# Altium project PnP.PrjPcb (part 1 of 2)
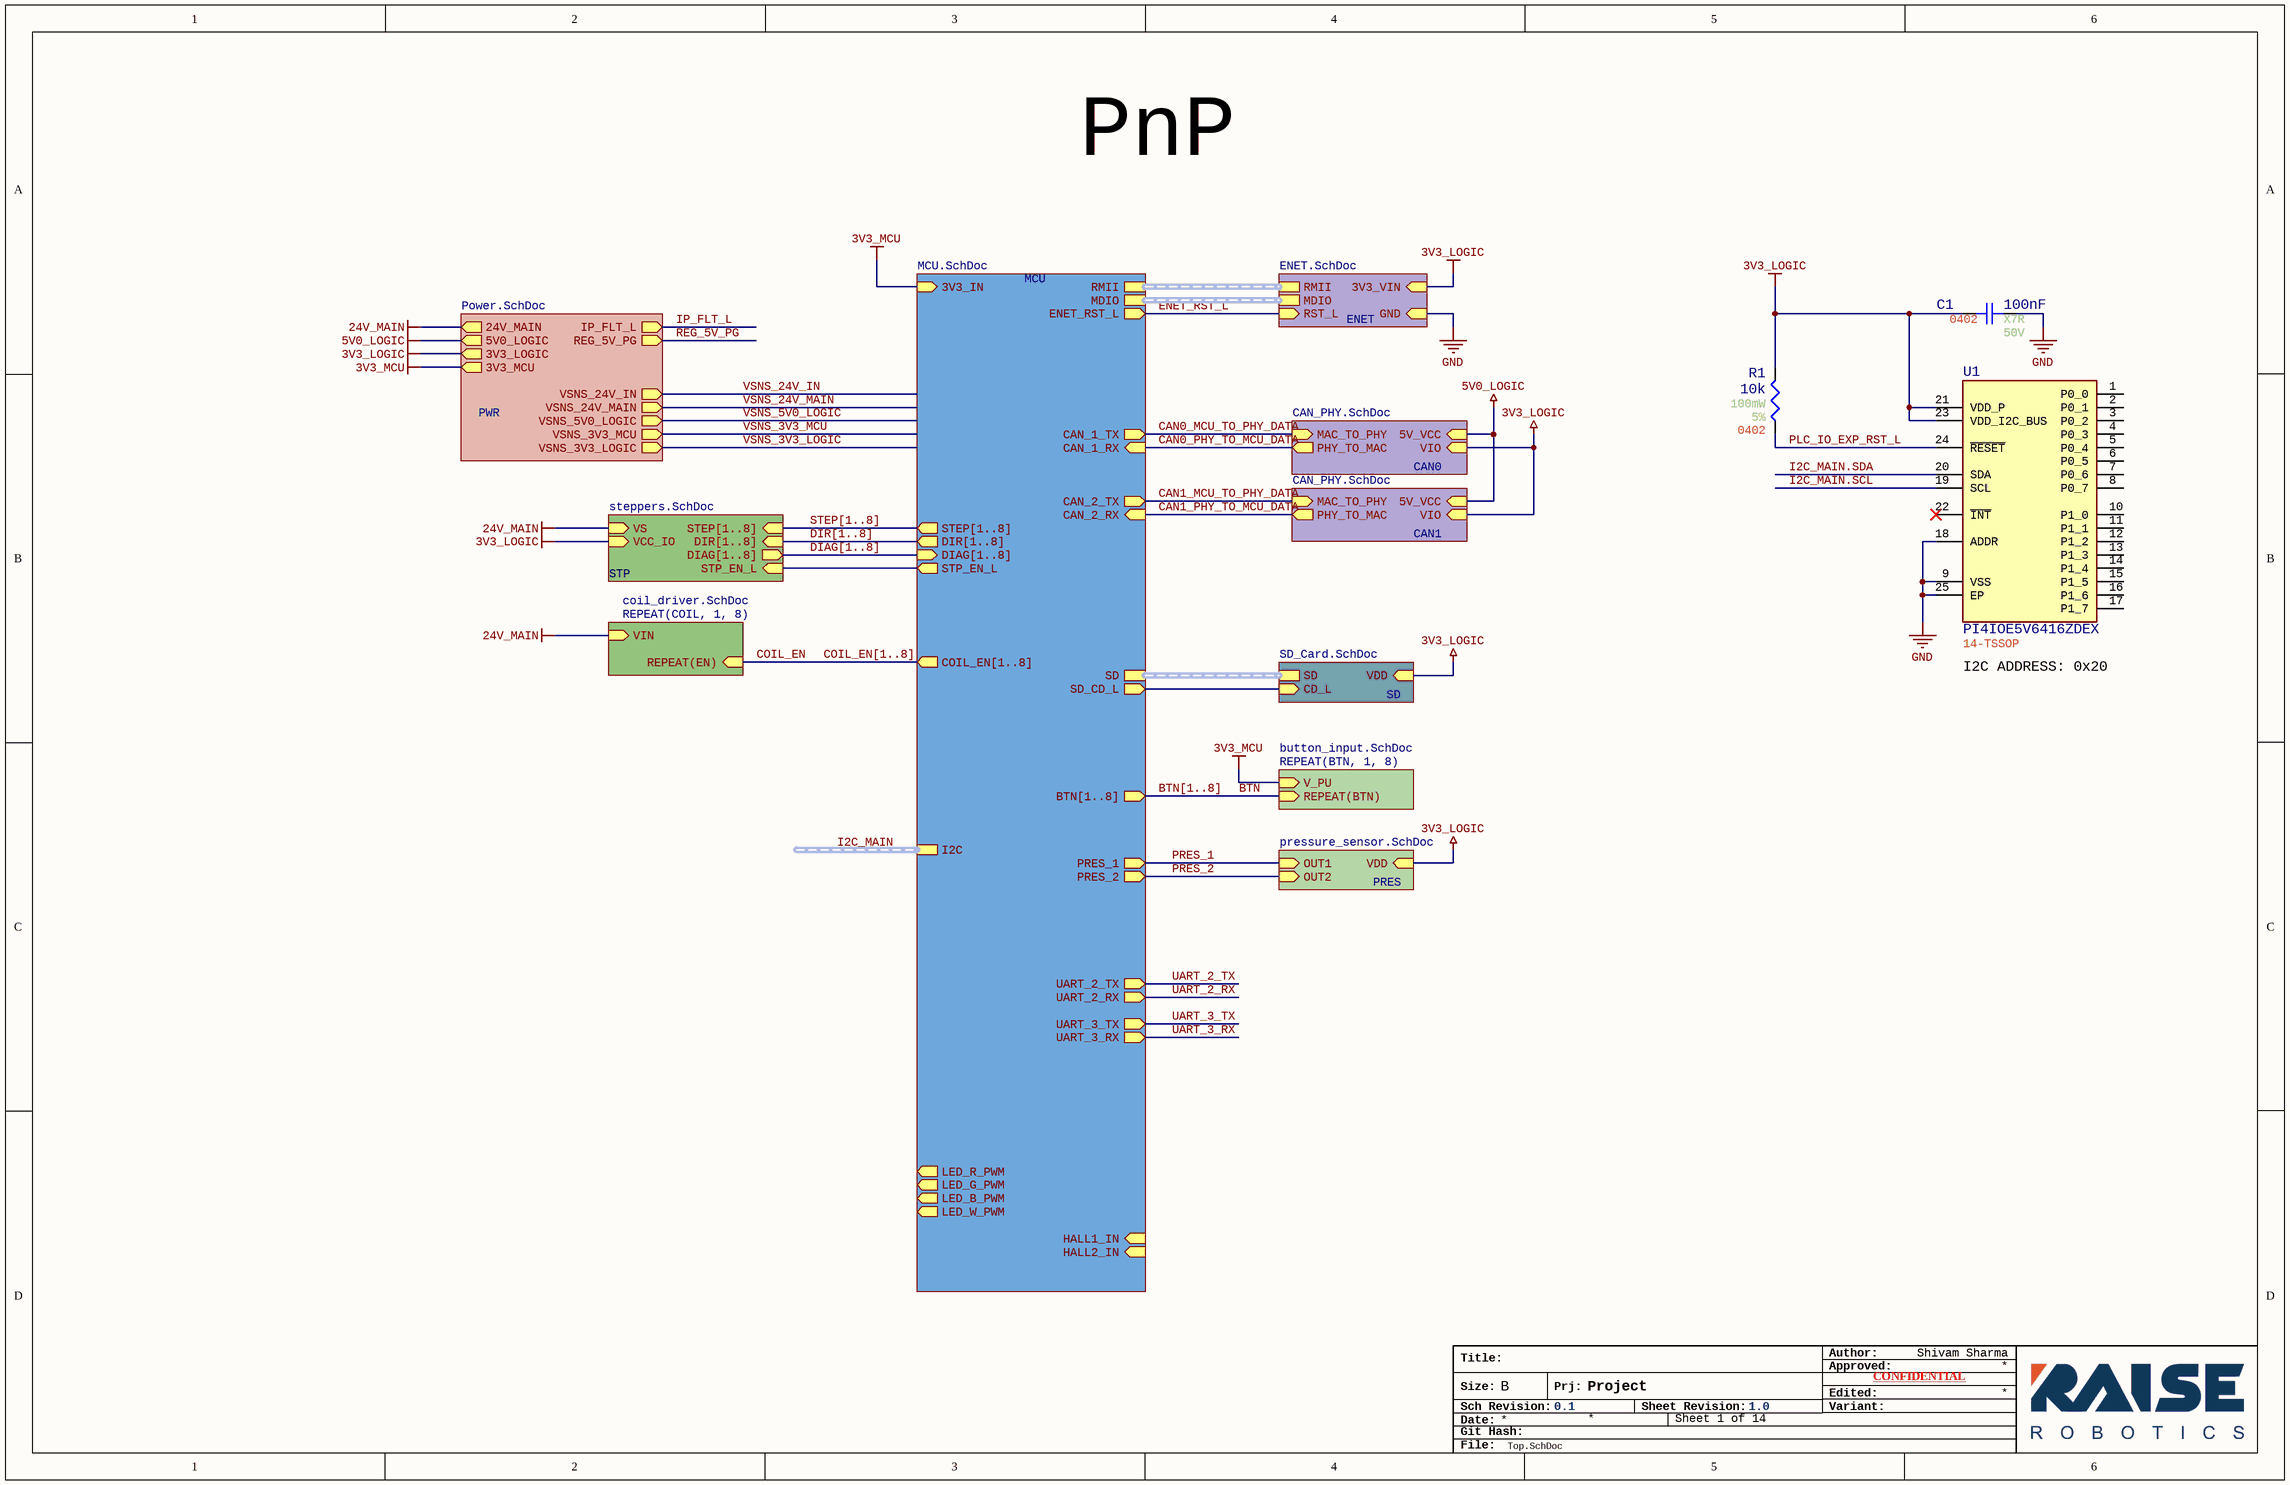
[diagram p0: Top.SchDoc]
PCBRevision: 0.0.1; ProjectTitle: Project; RR_PlaceNear: [{"paramVis":true,"a":{"refdes":"C7_MCU","srcUid":"MKZOVQBG","pin":"2"},"b":{"refdes":"U1_MCU","srcUid":"YJUBBWJW","pin":"73"},"mm":5},{"paramVis":true,"a":{"refdes":"C8_MCU","srcUid":"ILMRNPTO","pin":"2"},"b":{"refdes":"U1_MCU","srcUid":"YJUBBWJW","pin":"48"},"mm":5},{"paramVis":true,"a":{"refdes":"C13_MCU","srcUid":"YBZUFTTK","pin":"2"},"b":{"refdes":"U1_MCU","srcUid":"YJUBBWJW","pin":"100"},"mm":5},{"paramVis":true,"a":{"refdes":"C14_MCU","srcUid":"XZGWUZUA","pin":"2"},"b":{"refdes":"U1_MCU","srcUid":"YJUBBWJW","pin":"11"},"mm":5},{"paramVis":true,"a":{"refdes":"C15_MCU","srcUid":"LAALGSAD","pin":"2"},"b":{"refdes":"U1_MCU","srcUid":"YJUBBWJW","pin":"27"},"mm":5},{"paramVis":true,"a":{"refdes":"C16_MCU","srcUid":"AYAAMLSY","pin":"2"},"b":{"refdes":"U1_MCU","srcUid":"YJUBBWJW","pin":"50"},"mm":5},{"paramVis":true,"a":{"refdes":"C17_MCU","srcUid":"DWRWYZPW","pin":"2"},"b":{"refdes":"U1_MCU","srcUid":"YJUBBWJW","pin":"75"},"mm":5},{"paramVis":true,"a":{"refdes":"C18_MCU","srcUid":"ULGSEDIV","pin":"2"},"b":{"refdes":"U1_MCU","srcUid":"YJUBBWJW","pin":"21"},"mm":5}]; SchRevision: 0.1
12 sheets, 323 parts. Net scope: hierarchical (ports join the sheet entries above them; power ports are global).
Board file: Project.PcbDoc
Sheets:
  Top.SchDoc
    MCU = MCU.SchDoc
    PWR = Power.SchDoc
      U_Input_Protection = Input_Protection.SchDoc
      U_5V_Buck = 5V_Buck.SchDoc
    CAN0 = CAN_PHY.SchDoc
    CAN1 = CAN_PHY.SchDoc
    ENET = ENET.SchDoc
    SD = SD_Card.SchDoc
    BTN1 = button_input.SchDoc
    BTN2 = button_input.SchDoc
    BTN3 = button_input.SchDoc
    BTN4 = button_input.SchDoc
    BTN5 = button_input.SchDoc
    BTN6 = button_input.SchDoc
    BTN7 = button_input.SchDoc
    BTN8 = button_input.SchDoc
    STP = steppers.SchDoc
      STP1 = stepper_driver.SchDoc
      STP2 = stepper_driver.SchDoc
      STP3 = stepper_driver.SchDoc
      STP4 = stepper_driver.SchDoc
      STP5 = stepper_driver.SchDoc
      STP6 = stepper_driver.SchDoc
      STP7 = stepper_driver.SchDoc
      STP8 = stepper_driver.SchDoc
    COIL1 = coil_driver.SchDoc
    COIL2 = coil_driver.SchDoc
    COIL3 = coil_driver.SchDoc
    COIL4 = coil_driver.SchDoc
    COIL5 = coil_driver.SchDoc
    COIL6 = coil_driver.SchDoc
    COIL7 = coil_driver.SchDoc
    COIL8 = coil_driver.SchDoc

## Sheet Top.SchDoc
size 431 x 279 mm; Author: Shivam Sharma; SheetNumber: 1; SheetTotal: 14; SheetRevision: 1.0

### Parts
C1  value 100nF  Temperature Coefficient: X7R  Voltage Rating: 50V  Case/Package: 0402  [Generic 0402 capacitor]  (hidden comment: GRT155R71H104KE01D)
R1  value 10k  Power: 100mW  Tolerance: 5%  Case/Package: 0402  [Generic 0402 Resistor]  (hidden comment: ERJ-2GEJ103X)
U1  PI4IOE5V6416ZDEX  Case/Package: 14-TSSOP  [PI4IOE5V6416ZDEX]

### Sub-sheets
CAN0 = CAN_PHY.SchDoc: 5V_VCC (in), VIO (in), MAC_TO_PHY (in), PHY_TO_MAC (out)
CAN1 = CAN_PHY.SchDoc: 5V_VCC (in), VIO (in), MAC_TO_PHY (in), PHY_TO_MAC (out)
ENET = ENET.SchDoc: 3V3_VIN (in), GND (in), MDIO (harness MDIO), RMII (harness RMII), RST_L (in)
MCU = MCU.SchDoc: RMII (harness RMII), CAN_1_RX (in), CAN_1_TX (out), 3V3_IN (in), SD (harness SD), LED_R_PWM (out), LED_G_PWM (out), LED_B_PWM (out), LED_W_PWM (out), HALL2_IN (in), HALL1_IN (in), MDIO (harness MDIO), ENET_RST_L (out), SD_CD_L (out), UART_2_TX (out), UART_2_RX (out), UART_3_TX (out), UART_3_RX (out), CAN_2_RX (in), CAN_2_TX (out), STEP[1..8] (out), DIR[1..8] (out), DIAG[1..8] (in), STP_EN_L (out), I2C (harness I2C), COIL_EN[1..8] (out), BTN[1..8] (out), PRES_1 (out), PRES_2 (out)
PRES = pressure_sensor.SchDoc (file not in this document): VDD (in), OUT1 (in), OUT2 (in)
PWR = Power.SchDoc: IP_FLT_L (out), 24V_MAIN (out), 3V3_MCU (out), 3V3_LOGIC (out), 5V0_LOGIC (out), REG_5V_PG (out), VSNS_24V_IN (out), VSNS_24V_MAIN (out), VSNS_5V0_LOGIC (out), VSNS_3V3_MCU (out), VSNS_3V3_LOGIC (out)
REPEAT(BTN, 1, 8) = button_input.SchDoc: V_PU (in), REPEAT(BTN) (in)
REPEAT(COIL, 1, 8) = coil_driver.SchDoc: VIN (in), REPEAT(EN) (in)
SD = SD_Card.SchDoc: SD (harness SD), VDD (in), CD_L (in)
STP = steppers.SchDoc: STP_EN_L (in), DIAG[1..8] (out), VS (in), VCC_IO (in), STEP[1..8] (in), DIR[1..8] (in)

### Nets
3V3_LOGIC: C1.2 R1.2 U1.21(VDD_P) U1.23(VDD_I2C_BUS) ; sheet PWR/3V3_LOGIC, sheet CAN0/VIO, sheet CAN1/VIO, sheet ENET/3V3_VIN, sheet SD/VDD, sheet STP/VCC_IO, sheet PRES/VDD
3V3_MCU: sheet MCU/3V3_IN, sheet PWR/3V3_MCU, sheet REPEAT(BTN, 1, 8)/V_PU
5V0_LOGIC: sheet PWR/5V0_LOGIC, sheet CAN0/5V_VCC, sheet CAN1/5V_VCC
24V_MAIN: sheet PWR/24V_MAIN, sheet STP/VS, sheet REPEAT(COIL, 1, 8)/VIN
GND: C1.1 U1.9(VSS) U1.18(ADDR) U1.25(EP) ; sheet ENET/GND
BTN: sheet REPEAT(BTN, 1, 8)/REPEAT(BTN)
CAN0_MCU_TO_PHY_DATA: sheet MCU/CAN_1_TX, sheet CAN0/MAC_TO_PHY
CAN0_PHY_TO_MCU_DATA: sheet MCU/CAN_1_RX, sheet CAN0/PHY_TO_MAC
CAN1_MCU_TO_PHY_DATA: sheet MCU/CAN_2_TX, sheet CAN1/MAC_TO_PHY
CAN1_PHY_TO_MCU_DATA: sheet MCU/CAN_2_RX, sheet CAN1/PHY_TO_MAC
COIL_EN: sheet REPEAT(COIL, 1, 8)/REPEAT(EN)
ENET_RST_L: sheet MCU/ENET_RST_L, sheet ENET/RST_L
I2C_MAIN.SCL: U1.19(SCL)
I2C_MAIN.SDA: U1.20(SDA)
IP_FLT_L: sheet PWR/IP_FLT_L
PLC_IO_EXP_RST_L: R1.1 U1.24(~{RESET})
PRES_1: sheet MCU/PRES_1, sheet PRES/OUT1
PRES_2: sheet MCU/PRES_2, sheet PRES/OUT2
REG_5V_PG: sheet PWR/REG_5V_PG
SD_CD_L: sheet MCU/SD_CD_L, sheet SD/CD_L
STP_EN_L: sheet MCU/STP_EN_L, sheet STP/STP_EN_L
UART_2_RX: sheet MCU/UART_2_RX
UART_2_TX: sheet MCU/UART_2_TX
UART_3_RX: sheet MCU/UART_3_RX
UART_3_TX: sheet MCU/UART_3_TX

Not connected (* = marked no-connect by the designer): U1 1(P0_0) 2(P0_1) 3(P0_2) 4(P0_3) 5(P0_4) 6(P0_5) 7(P0_6) 8(P0_7) 10(P1_0) 11(P1_1) 12(P1_2) 13(P1_3) 14(P1_4) 15(P1_5) 16(P1_6) 17(P1_7) 22(~{INT})*

### Buses and harness runs
bus BTN[1..8] = sheet MCU/BTN[1..8]
bus COIL_EN[1..8] = sheet MCU/COIL_EN[1..8]
bus DIAG[1..8] = sheet MCU/DIAG[1..8] = sheet STP/DIAG[1..8]
bus DIR[1..8] = sheet MCU/DIR[1..8] = sheet STP/DIR[1..8]
bus STEP[1..8] = sheet MCU/STEP[1..8] = sheet STP/STEP[1..8]
harness I2C_MAIN = sheet MCU/I2C
harness sheet ENET/MDIO = sheet MCU/MDIO
harness sheet ENET/RMII = sheet MCU/RMII
harness sheet MCU/SD = sheet SD/SD

### Notes on the sheet
- PnP
- (near U1) I2C ADDRESS: 0x20
- Title:
- Author:
- Approved:
- Size:
- Date:
- Git Hash:
- Sch Revision:
- B
- Prj:
- Sheet Revision:
- Variant:
- Edited:
- CONFIDENTIAL
- File:

### Library data of the parts
C1 = CMP-001-00084-12: Ceramic Capacitor, Multilayer, Ceramic, 50V, 10% +Tol, 10% -Tol, X7R, 15% TC, 0.1uF, Surface Mount, 0402; AECQ: Yes; Reach SVHC Compliant: Yes; Mounting Technology: Surface Mount; Termination: Wraparound; Pins: 2; Packaging: Tape and Reel; Package Shape: Rectangular; Multilayer: Yes; Tolerance: 10%; Max Operating Temperature: 125°C; Terminal Finish: Nickel; Capacitor Type: Ceramic; Dielectric Material: Ceramic; Min Operating Temperature: -55°C; RoHS Compliant: Yes
R1 = CMP-009-00185-9: Res Thick Film 0402 10K Ohm 5% 1/10W ±200ppm/°C Molded SMD Punched Carrier T/R; AECQ: No; Pins: 2; Max Operating Temperature: 155°C; RoHS Compliant: Yes; Min Operating Temperature: -55°C; Mounting Technology: Surface Mount
U1 = CMP-031-00013-2: 16-bit I2C General Purpose IO Expander with Interrupt, Reset, -40 to 85 °C, RoHS; Number of Circuits: 1; AECQ: No; Min Supply Voltage: 1.65V; Max Supply Voltage: 5.5V; Number of Terminals: 24; Schedule B: 8542390000, 8542390000; Pins: 14; RoHS: Compliant; Max Operating Temperature: 85°C; Lifecycle Status: Production; Terminal Pitch: 500µm; Width: 4mm; Min Operating Temperature: -40°C; REACH SVHC: Yes; Length: 4mm; Height - Seated (Max): 900µm; MPN: PI4IOE5V6416ZDEX

## Sheet MCU.SchDoc
size 431 x 279 mm; Author: Shivam Sharma; SheetNumber: 2; SheetTotal: 14
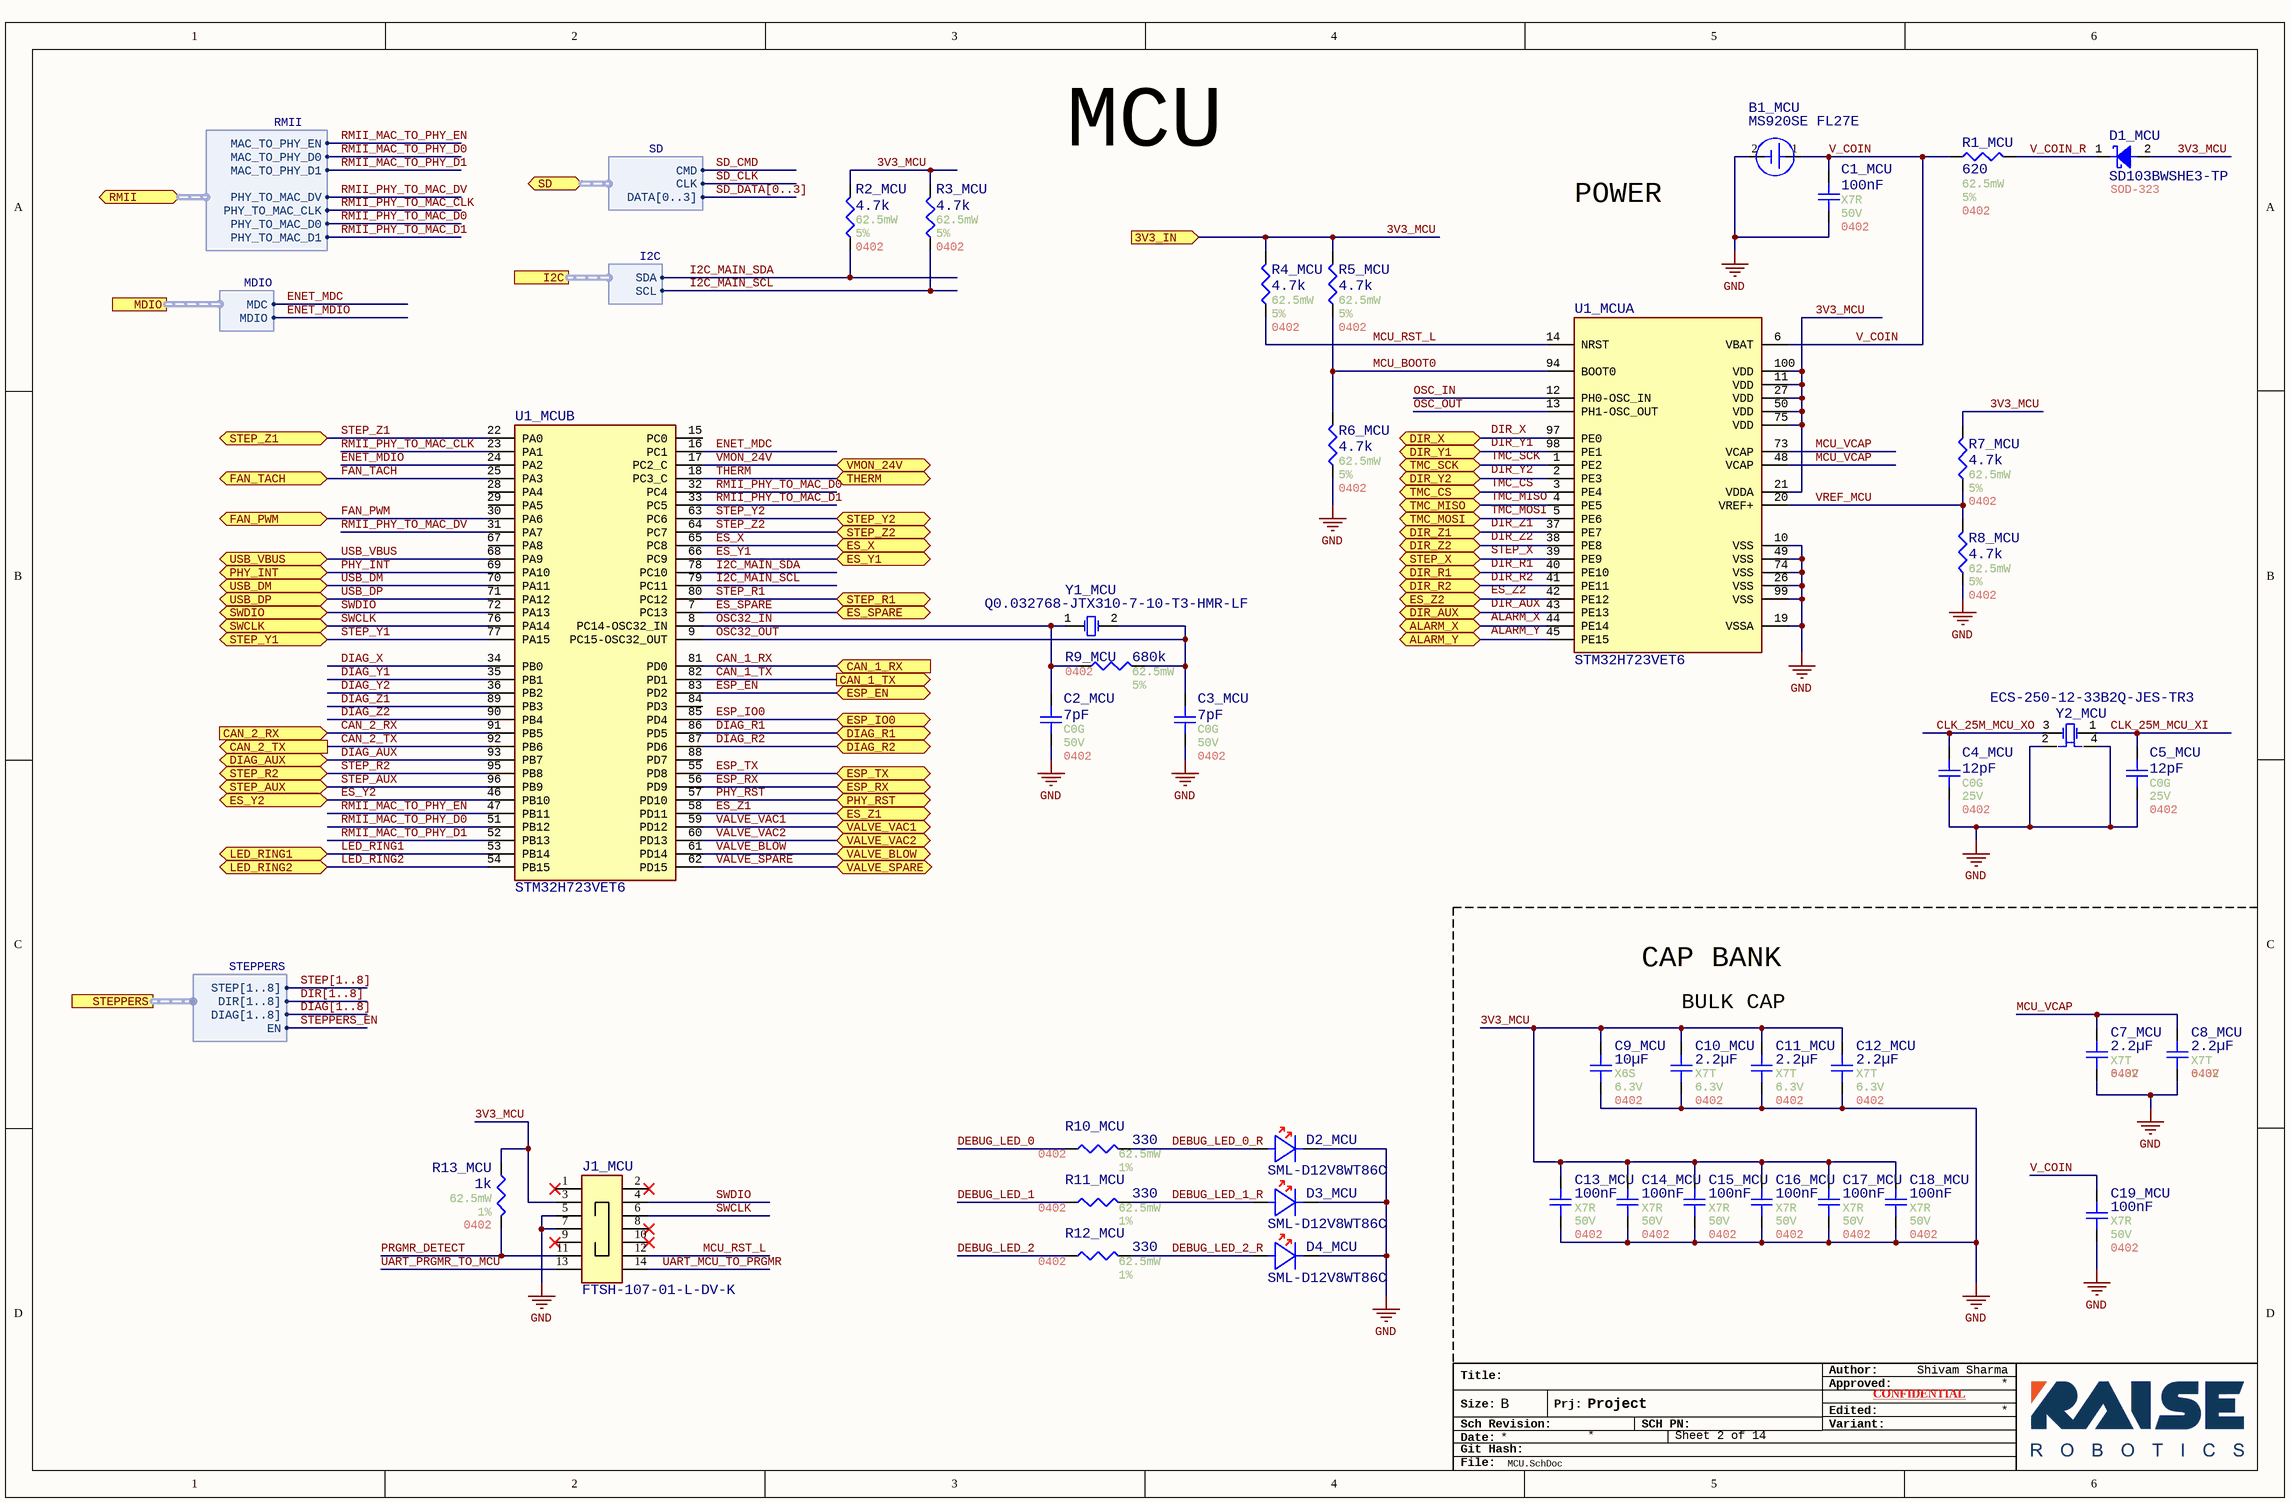
[diagram p1: MCU.SchDoc]

### Parts
B1_MCU  MS920SE FL27E  [MS920SE-FL27E]
C1_MCU  value 100nF  Temperature Coefficient: X7R  Voltage Rating: 50V  Case/Package: 0402  [Generic 0402 capacitor]  (hidden comment: GRT155R71H104KE01D)
C2_MCU  value 7pF  Temperature Coefficient: C0G  Voltage Rating: 50V  Case/Package: 0402  [Generic 0402 capacitor]  (hidden comment: GCM1555C1H7R0CA16J)
C3_MCU  value 7pF  Temperature Coefficient: C0G  Voltage Rating: 50V  Case/Package: 0402  [Generic 0402 capacitor]  (hidden comment: GCM1555C1H7R0CA16J)
C4_MCU  value 12pF  Temperature Coefficient: C0G  Voltage Rating: 25V  Case/Package: 0402  [Generic 0402 capacitor]  (hidden comment: GRT1555C1E120JA02J)
C5_MCU  value 12pF  Temperature Coefficient: C0G  Voltage Rating: 25V  Case/Package: 0402  [Generic 0402 capacitor]  (hidden comment: GRT1555C1E120JA02J)
C7_MCU  value 2.2µF  Temperature Coefficient: X7T  Voltage Rating: 6.3V  Case/Package: 0402  [Generic 0402 capacitor]  (hidden comment: MAASJ105CD7225MFCA01)
C8_MCU  value 2.2µF  Temperature Coefficient: X7T  Voltage Rating: 6.3V  Case/Package: 0402  [Generic 0402 capacitor]  (hidden comment: MAASJ105CD7225MFCA01)
C9_MCU  value 10µF  Temperature Coefficient: X6S  Voltage Rating: 6.3V  Case/Package: 0402  [Generic 0402 capacitor]  (hidden comment: GRT155C80J106ME13J)
C10_MCU  value 2.2µF  Temperature Coefficient: X7T  Voltage Rating: 6.3V  Case/Package: 0402  [Generic 0402 capacitor]  (hidden comment: MAASJ105CD7225MFCA01)
C11_MCU  value 2.2µF  Temperature Coefficient: X7T  Voltage Rating: 6.3V  Case/Package: 0402  [Generic 0402 capacitor]  (hidden comment: MAASJ105CD7225MFCA01)
C12_MCU  value 2.2µF  Temperature Coefficient: X7T  Voltage Rating: 6.3V  Case/Package: 0402  [Generic 0402 capacitor]  (hidden comment: MAASJ105CD7225MFCA01)
C13_MCU  value 100nF  Temperature Coefficient: X7R  Voltage Rating: 50V  Case/Package: 0402  [Generic 0402 capacitor]  (hidden comment: GRT155R71H104KE01D)
C14_MCU  value 100nF  Temperature Coefficient: X7R  Voltage Rating: 50V  Case/Package: 0402  [Generic 0402 capacitor]  (hidden comment: GRT155R71H104KE01D)
C15_MCU  value 100nF  Temperature Coefficient: X7R  Voltage Rating: 50V  Case/Package: 0402  [Generic 0402 capacitor]  (hidden comment: GRT155R71H104KE01D)
C16_MCU  value 100nF  Temperature Coefficient: X7R  Voltage Rating: 50V  Case/Package: 0402  [Generic 0402 capacitor]  (hidden comment: GRT155R71H104KE01D)
C17_MCU  value 100nF  Temperature Coefficient: X7R  Voltage Rating: 50V  Case/Package: 0402  [Generic 0402 capacitor]  (hidden comment: GRT155R71H104KE01D)
C18_MCU  value 100nF  Temperature Coefficient: X7R  Voltage Rating: 50V  Case/Package: 0402  [Generic 0402 capacitor]  (hidden comment: GRT155R71H104KE01D)
C19_MCU  value 100nF  Temperature Coefficient: X7R  Voltage Rating: 50V  Case/Package: 0402  [Generic 0402 capacitor]  (hidden comment: GRT155R71H104KE01D)
D1_MCU  SD103BWSHE3-TP  [SOD-323]
D2_MCU  SML-D12V8WT86C  [FP-SML-D12-MFG]
D3_MCU  SML-D12V8WT86C  [FP-SML-D12-MFG]
D4_MCU  SML-D12V8WT86C  [FP-SML-D12-MFG]
J1_MCU  FTSH-107-01-L-DV-K  [FTSH-107-01-L-DV-K-TR]
R1_MCU  value 620  Power: 62.5mW  Tolerance: 5%  Case/Package: 0402  [Generic 0402 Resistor]  (hidden comment: RC0402JR-07620RL)
R2_MCU  value 4.7k  Power: 62.5mW  Tolerance: 5%  Case/Package: 0402  [Generic 0402 Resistor]  (hidden comment: WR04X472JTL)
R3_MCU  value 4.7k  Power: 62.5mW  Tolerance: 5%  Case/Package: 0402  [Generic 0402 Resistor]  (hidden comment: WR04X472JTL)
R4_MCU  value 4.7k  Power: 62.5mW  Tolerance: 5%  Case/Package: 0402  [Generic 0402 Resistor]  (hidden comment: WR04X472JTL)
R5_MCU  value 4.7k  Power: 62.5mW  Tolerance: 5%  Case/Package: 0402  [Generic 0402 Resistor]  (hidden comment: WR04X472JTL)
R6_MCU  value 4.7k  Power: 62.5mW  Tolerance: 5%  Case/Package: 0402  [Generic 0402 Resistor]  (hidden comment: WR04X472JTL)
R7_MCU  value 4.7k  Power: 62.5mW  Tolerance: 5%  Case/Package: 0402  [Generic 0402 Resistor]  (hidden comment: WR04X472JTL)
R8_MCU  value 4.7k  Power: 62.5mW  Tolerance: 5%  Case/Package: 0402  [Generic 0402 Resistor]  (hidden comment: WR04X472JTL)
R9_MCU  value 680k  Power: 62.5mW  Tolerance: 5%  Case/Package: 0402  [Generic 0402 Resistor]  (hidden comment: AC0402JR-07680KL)
R10_MCU  value 330  Power: 62.5mW  Tolerance: 1%  Case/Package: 0402  [Generic 0402 Resistor]  (hidden comment: RMCF0402FT330R)
R11_MCU  value 330  Power: 62.5mW  Tolerance: 1%  Case/Package: 0402  [Generic 0402 Resistor]  (hidden comment: RMCF0402FT330R)
R12_MCU  value 330  Power: 62.5mW  Tolerance: 1%  Case/Package: 0402  [Generic 0402 Resistor]  (hidden comment: RMCF0402FT330R)
R13_MCU  value 1k  Power: 62.5mW  Tolerance: 1%  Case/Package: 0402  [Generic 0402 Resistor]  (hidden comment: WR04X1001FTL)
U1_MCU  STM32H723VET6  [STM32H723VxT]  (parts A,B of 2)
Y1_MCU  Q0.032768-JTX310-7-10-T3-HMR-LF  [JTX310]
Y2_MCU  ECS-250-12-33B2Q-JES-TR3  [ECS-250-12-33B2Q-JES-TR3]

### Ports
3V3_IN (in), ALARM_X (bidir), ALARM_Y (bidir), CAN_1_RX (in), CAN_1_TX (out), CAN_2_RX (in), CAN_2_TX (out), DIAG_AUX (bidir), DIAG_R1 (bidir), DIAG_R2 (bidir), DIR_AUX (bidir), DIR_R1 (bidir), DIR_R2 (bidir), DIR_X (bidir), DIR_Y1 (bidir), DIR_Y2 (bidir), DIR_Z1 (bidir), DIR_Z2 (bidir), ES_SPARE (bidir), ES_X (bidir), ES_Y1 (bidir), ES_Y2 (bidir), ES_Z1 (bidir), ES_Z2 (bidir), ESP_EN (bidir), ESP_IO0 (bidir), ESP_RX (bidir), ESP_TX (bidir), FAN_PWM (bidir), FAN_TACH (bidir), I2C (harness I2C), LED_RING1 (bidir), LED_RING2 (bidir), MDIO (harness MDIO), PHY_INT (bidir), PHY_RST (bidir), RMII (bidir, harness RMII), SD (bidir, harness SD), STEP_AUX (bidir), STEP_R1 (bidir), STEP_R2 (bidir), STEP_X (bidir), STEP_Y1 (bidir), STEP_Y2 (bidir), STEP_Z1 (bidir), STEP_Z2 (bidir), STEPPERS (harness STEPPERS), SWCLK (bidir), SWDIO (bidir), THERM (bidir), TMC_CS (bidir), TMC_MISO (bidir), TMC_MOSI (bidir), TMC_SCK (bidir), USB_DM (bidir), USB_DP (bidir), USB_VBUS (bidir), VALVE_BLOW (bidir), VALVE_SPARE (bidir), VALVE_VAC1 (bidir), VALVE_VAC2 (bidir), VMON_24V (bidir)

### Harnesses
RMII: MAC_TO_PHY_D0, MAC_TO_PHY_D1, PHY_TO_MAC_D0, PHY_TO_MAC_CLK, PHY_TO_MAC_D1, MAC_TO_PHY_EN, PHY_TO_MAC_DV
SD: DATA[0..3], CLK, CMD
MDIO: MDIO, MDC
I2C: SDA, SCL
STEPPERS: STEP[1..8], DIR[1..8], DIAG[1..8], EN

### Nets
3V3_MCU: C9_MCU.2 C10_MCU.2 C11_MCU.2 C12_MCU.2 C13_MCU.2 C14_MCU.2 C15_MCU.2 C16_MCU.2 C17_MCU.2 C18_MCU.2 D1_MCU.2(A) J1_MCU.3 R2_MCU.2 R3_MCU.2 R4_MCU.2 R5_MCU.2 R7_MCU.2 R13_MCU.2 U1_MCU.11(VDD) U1_MCU.21(VDDA) U1_MCU.27(VDD) U1_MCU.50(VDD) U1_MCU.75(VDD) U1_MCU.100(VDD) ; port 3V3_IN
GND: B1_MCU.2 C1_MCU.1 C2_MCU.1 C3_MCU.1 C4_MCU.1 C5_MCU.1 C7_MCU.1 C8_MCU.1 C9_MCU.1 C10_MCU.1 C11_MCU.1 C12_MCU.1 C13_MCU.1 C14_MCU.1 C15_MCU.1 C16_MCU.1 C17_MCU.1 C18_MCU.1 C19_MCU.1 D2_MCU.1(C) D3_MCU.1(C) D4_MCU.1(C) J1_MCU.5 J1_MCU.7 R6_MCU.1 R8_MCU.1 U1_MCU.10(VSS) U1_MCU.19(VSSA) U1_MCU.26(VSS) U1_MCU.49(VSS) U1_MCU.74(VSS) U1_MCU.99(VSS) Y2_MCU.2 Y2_MCU.4
ALARM_X: U1_MCU.44(PE14) ; port ALARM_X
ALARM_Y: U1_MCU.45(PE15) ; port ALARM_Y
CAN_1_RX: U1_MCU.81(PD0) ; port CAN_1_RX  [project net CAN0_PHY_TO_MCU_DATA]
CAN_1_TX: U1_MCU.82(PD1) ; port CAN_1_TX  [project net CAN0_MCU_TO_PHY_DATA]
CAN_2_RX: U1_MCU.91(PB5) ; port CAN_2_RX  [project net CAN1_PHY_TO_MCU_DATA]
CAN_2_TX: U1_MCU.92(PB6) ; port CAN_2_TX  [project net CAN1_MCU_TO_PHY_DATA]
CLK_25M_MCU_XI: C5_MCU.2 Y2_MCU.1
CLK_25M_MCU_XO: C4_MCU.2 Y2_MCU.3
DEBUG_LED_0: R10_MCU.1
DEBUG_LED_0_R: D2_MCU.2(A) R10_MCU.2
DEBUG_LED_1: R11_MCU.1
DEBUG_LED_1_R: D3_MCU.2(A) R11_MCU.2
DEBUG_LED_2: R12_MCU.1
DEBUG_LED_2_R: D4_MCU.2(A) R12_MCU.2
DIAG[1..8]: port STEPPERS.DIAG[1..8]
DIAG_AUX: U1_MCU.93(PB7) ; port DIAG_AUX
DIAG_R1: U1_MCU.86(PD5) ; port DIAG_R1
DIAG_R2: U1_MCU.87(PD6) ; port DIAG_R2
DIAG_X: U1_MCU.34(PB0)
DIAG_Y1: U1_MCU.35(PB1)
DIAG_Y2: U1_MCU.36(PB2)
DIAG_Z1: U1_MCU.89(PB3)
DIAG_Z2: U1_MCU.90(PB4)
DIR[1..8]: port STEPPERS.DIR[1..8]
DIR_AUX: U1_MCU.43(PE13) ; port DIR_AUX
DIR_R1: U1_MCU.40(PE10) ; port DIR_R1
DIR_R2: U1_MCU.41(PE11) ; port DIR_R2
DIR_X: U1_MCU.97(PE0) ; port DIR_X
DIR_Y1: U1_MCU.98(PE1) ; port DIR_Y1
DIR_Y2: U1_MCU.2(PE3) ; port DIR_Y2
DIR_Z1: U1_MCU.37(PE7) ; port DIR_Z1
DIR_Z2: U1_MCU.38(PE8) ; port DIR_Z2
ENET_MDC: U1_MCU.16(PC1) ; port MDIO.MDC
ENET_MDIO: U1_MCU.24(PA2) ; port MDIO.MDIO
ES_SPARE: U1_MCU.7(PC13) ; port ES_SPARE
ES_X: U1_MCU.65(PC8) ; port ES_X
ES_Y1: U1_MCU.66(PC9) ; port ES_Y1
ES_Y2: U1_MCU.46(PB10) ; port ES_Y2
ES_Z1: U1_MCU.58(PD11) ; port ES_Z1
ES_Z2: U1_MCU.42(PE12) ; port ES_Z2
ESP_EN: U1_MCU.83(PD2) ; port ESP_EN
ESP_IO0: U1_MCU.85(PD4) ; port ESP_IO0
ESP_RX: U1_MCU.56(PD9) ; port ESP_RX
ESP_TX: U1_MCU.55(PD8) ; port ESP_TX
FAN_PWM: U1_MCU.30(PA6) ; port FAN_PWM
FAN_TACH: U1_MCU.25(PA3) ; port FAN_TACH
I2C_MAIN_SCL: R3_MCU.1 U1_MCU.79(PC11) ; port I2C.SCL  [project net I2C_MAIN.SCL]
I2C_MAIN_SDA: R2_MCU.1 U1_MCU.78(PC10) ; port I2C.SDA  [project net I2C_MAIN.SDA]
LED_RING1: U1_MCU.53(PB14) ; port LED_RING1
LED_RING2: U1_MCU.54(PB15) ; port LED_RING2
MCU_BOOT0: R5_MCU.1 R6_MCU.2 U1_MCU.94(BOOT0)
MCU_RST_L: J1_MCU.12 R4_MCU.1 U1_MCU.14(NRST)
MCU_VCAP: C7_MCU.2 C8_MCU.2 U1_MCU.48(VCAP) U1_MCU.73(VCAP)
OSC32_IN: C2_MCU.2 R9_MCU.1 U1_MCU.8(PC14-OSC32_IN) Y1_MCU.1
OSC32_OUT: C3_MCU.2 R9_MCU.2 U1_MCU.9(PC15-OSC32_OUT) Y1_MCU.2
OSC_IN: U1_MCU.12(PH0-OSC_IN)
OSC_OUT: U1_MCU.13(PH1-OSC_OUT)
PHY_INT: U1_MCU.69(PA10) ; port PHY_INT
PHY_RST: U1_MCU.57(PD10) ; port PHY_RST
PRGMR_DETECT: J1_MCU.11 R13_MCU.1
RMII_MAC_TO_PHY_D0: U1_MCU.51(PB12) ; port RMII.MAC_TO_PHY_D0
RMII_MAC_TO_PHY_D1: U1_MCU.52(PB13) ; port RMII.MAC_TO_PHY_D1
RMII_MAC_TO_PHY_EN: U1_MCU.47(PB11) ; port RMII.MAC_TO_PHY_EN
RMII_PHY_TO_MAC_CLK: U1_MCU.23(PA1) ; port RMII.PHY_TO_MAC_CLK
RMII_PHY_TO_MAC_D0: U1_MCU.32(PC4) ; port RMII.PHY_TO_MAC_D0
RMII_PHY_TO_MAC_D1: U1_MCU.33(PC5) ; port RMII.PHY_TO_MAC_D1
RMII_PHY_TO_MAC_DV: U1_MCU.31(PA7) ; port RMII.PHY_TO_MAC_DV
STEP[1..8]: port STEPPERS.STEP[1..8]
STEP_AUX: U1_MCU.96(PB9) ; port STEP_AUX
STEP_R1: U1_MCU.80(PC12) ; port STEP_R1
STEP_R2: U1_MCU.95(PB8) ; port STEP_R2
STEP_X: U1_MCU.39(PE9) ; port STEP_X
STEP_Y1: U1_MCU.77(PA15) ; port STEP_Y1
STEP_Y2: U1_MCU.63(PC6) ; port STEP_Y2
STEP_Z1: U1_MCU.22(PA0) ; port STEP_Z1
STEP_Z2: U1_MCU.64(PC7) ; port STEP_Z2
STEPPERS_EN: port STEPPERS.EN
SWCLK: J1_MCU.6 U1_MCU.76(PA14) ; port SWCLK
SWDIO: J1_MCU.4 U1_MCU.72(PA13) ; port SWDIO
THERM: U1_MCU.18(PC3_C) ; port THERM
TMC_CS: U1_MCU.3(PE4) ; port TMC_CS
TMC_MISO: U1_MCU.4(PE5) ; port TMC_MISO
TMC_MOSI: U1_MCU.5(PE6) ; port TMC_MOSI
TMC_SCK: U1_MCU.1(PE2) ; port TMC_SCK
UART_MCU_TO_PRGMR: J1_MCU.14
UART_PRGMR_TO_MCU: J1_MCU.13
USB_DM: U1_MCU.70(PA11) ; port USB_DM
USB_DP: U1_MCU.71(PA12) ; port USB_DP
USB_VBUS: U1_MCU.68(PA9) ; port USB_VBUS
V_COIN: B1_MCU.1 C1_MCU.2 C19_MCU.2 R1_MCU.1 U1_MCU.6(VBAT)
V_COIN_R: D1_MCU.1(C) R1_MCU.2
VALVE_BLOW: U1_MCU.61(PD14) ; port VALVE_BLOW
VALVE_SPARE: U1_MCU.62(PD15) ; port VALVE_SPARE
VALVE_VAC1: U1_MCU.59(PD12) ; port VALVE_VAC1
VALVE_VAC2: U1_MCU.60(PD13) ; port VALVE_VAC2
VMON_24V: U1_MCU.17(PC2_C) ; port VMON_24V
VREF_MCU: R7_MCU.1 R8_MCU.2 U1_MCU.20(VREF+)

Not connected (* = marked no-connect by the designer): J1_MCU 1* 2* 8* 9* 10*; U1_MCU 15(PC0) 28(PA4) 29(PA5) 67(PA8) 84(PD3) 88(PD7)

### Buses and harness runs
bus SD_DATA[0..3]

### Notes on the sheet
- MCU
- POWER
- CAP BANK
- BULK CAP
- Labels drawn without touching a wire or pin: ALARM_X, ALARM_Y, DIR_AUX, DIR_R1, DIR_R2, DIR_X, DIR_Y1, DIR_Y2, DIR_Z1, DIR_Z2, ES_Z2, STEP_X, TMC_CS, TMC_MISO, TMC_MOSI, TMC_SCK
- Title:
- Author:
- Approved:
- Size:
- Date:
- Git Hash:
- Sch Revision:
- B
- Prj:
- SCH PN:
- Variant:
- Edited:
- CONFIDENTIAL
- File:

### Library data of the parts
B1_MCU = CMP-00029-00001-1: Secondary Battery, Manganese Silicon Lithium, 3V, 0.011Ah; Pins: 2; RoHS Compliant: Yes; Voltage Rating: 3V
C1_MCU C13_MCU C14_MCU C15_MCU C16_MCU C17_MCU C18_MCU C19_MCU = CMP-001-00084-12: as C1 on sheet Top; Reach SVHC Compliant: Yes; Mounting Technology: Surface Mount; Termination: Wraparound; Pins: 2; Packaging: Tape and Reel; Package Shape: Rectangular; Multilayer: Yes; Tolerance: 10%; Max Operating Temperature: 125°C; Terminal Finish: Nickel; Capacitor Type: Ceramic; Dielectric Material: Ceramic; Min Operating Temperature: -55°C; RoHS Compliant: Yes
C2_MCU C3_MCU = CMP-001-00111-2: Ceramic Capacitor, Multilayer, Ceramic, 50V, 3.57% +Tol, 3.57% -Tol, C0G, 30ppm/Cel TC, 0.000007uF, Surface Mount, 0402; AECQ: Yes; Tolerance: 3.5%; Mounting Technology: Surface Mount; Pins: 2; Min Operating Temperature: -55°C; Max Operating Temperature: 125°C; Capacitor Type: Ceramic; RoHS Compliant: Yes
C4_MCU C5_MCU = CMP-001-00109-2: Ceramic Capacitor, Multilayer, Ceramic, 25V, 5% +Tol, 5% -Tol, C0G, 30ppm/Cel TC, 0.000012uF, Surface Mount, 0402; AECQ: Yes; Pins: 2; Mounting Technology: Surface Mount; Min Operating Temperature: -55°C; RoHS Compliant: Yes; Max Operating Temperature: 125°C; Tolerance: 5%; Capacitor Type: Ceramic
C7_MCU C8_MCU C10_MCU C11_MCU C12_MCU = CMP-001-00096-4: Mlcc, 2.2 Uf, # 20 %, 0402, 6.3V, X7T, T&r Q200; Tolerance: 20%; Capacitor Type: Ceramic; AECQ: Yes; Mounting Technology: SMD; Pins: 2; Max Operating Temperature: 125°C; Min Operating Temperature: -55°C
C9_MCU = CMP-001-00108-2: Multilayer Ceramic Capacitors MLCC - SMD/SMT 0402 10uF 6.3VDC 20% X6S AEC-Q200; AECQ: Yes; Mounting Technology: Surface Mount; Max Operating Temperature: 105°C; Min Operating Temperature: -55°C; Tolerance: 20%; Pins: 2; RoHS Compliant: Yes; Capacitor Type: Ceramic
D1_MCU = CMP-004-00038-1: Rectifier Diode, Schottky, 1 Phase, 1 Element, 0.35A, 30V V(RRM), Silicon; Reverse Recovery Time: 10ns; Forward Voltage: 370mV; Forward Current: 350mA; Min Operating Temperature: -55°C; Max Operating Temperature: 125°C; RoHS Compliant: Yes; Min Breakdown Voltage: 30V; Max Output current: 350mA; Case/Package: SOD-323; Pins: 2
D2_MCU D3_MCU D4_MCU = CMP-007-00036-1: Red 630nm LED Indication - Discrete 2.2V 0603 (1608 Metric); Case/Package: 0603; Forward Voltage: 2.2V; Colour: Red; Pins: 2
J1_MCU = CMP-002-00103-1: Board Connector, 14 Contact(s), 2 Row(s), Male, Straight, 0.05 inch Pitch, Surface Mount Terminal, Locking, Receptacle; Manufacturer: Samtec; Manufacturer Series: FTSH; Filter Feature: No; Number of Contacts: 14; Plating Thickness: 10uin; Number Of Connectors: 1; Contact Pattern: RECTANGULAR; Body Length: 0.35inch; Mating Information: MULTIPLE MATING PARTS AVAILABLE; PCB Contact Row Spacing: 4.064mm; Reference Standard: UL; Number Of PCB Rows: 2; Option: General Purpose; Body Breadth: 0.135inch; Max Current Rating: 3.4A; Reliability: COMMERCIAL; Contact Style: SQ PIN-SKT; Body/Shell Style: RECEPTACLE; Mounting Style: STRAIGHT; Contact Material: Bronze; Terminal Pitch: 1.27mm; Termination: SMD/SMT; Reach SVHC Compliant: Yes; IEC Conformance: No; Connector Type: BOARD CONNECTOR; MIL Conformance: No; RoHS Compliant: Yes; PCB Contact Pattern: RECTANGULAR; Flammability Rating: UL94 V-0; Gender: Male; Mating Contact Pitch: 0.05inch; Insulation Material: Polymer; Number of Rows Loaded: 2; Contact Finish - Mating: GOLD (10) OVER NICKEL (50); Mating Contact Row Spacing: 0.05inch; DIN Conformance: No; Pins: 14; Mounting Option 1: LOCKING; Contact Finish - Termination: Tin (Sn) - with Nickel (Ni) barrier; JESD-609 Code: e3; Contact Gender: Male; Mixed Contacts: No; Mounting Technology: Board
R1_MCU = CMP-009-00209-4: Fixed Resistor, Metal Glaze/thick Film, 0.0625W, 620ohm, 50V, 5% +/-Tol, 100ppm/Cel, Surface Mount, 0402; AECQ: No; RoHS Compliant: Yes; Min Operating Temperature: -55°C; Max Operating Temperature: 155°C; Pins: 2; Mounting Technology: Surface Mount
R2_MCU R3_MCU R4_MCU R5_MCU R6_MCU R7_MCU R8_MCU = CMP-009-00184-8: Fixed Resistor, Metal Glaze/thick Film, 0.0625W, 4700ohm, 50V, 5% +/-Tol, 100ppm/Cel, Surface Mount, 0402; Manufacturer Part Number: Blank; Package Height: 0.35mm; Package Length: 1mm; Rated Temperature: 70°C; Package Width: 0.5mm; AECQ: No; Temperature Coefficient (ppm/Cel): 200; Additional Feature: LASER TRIMMABLE; Mounting Technology: Surface Mount; Technology: METAL GLAZE/THICK FILM; RoHS Compliant: Yes; Resistor Type: FIXED RESISTOR; Package Shape: Rectangular; Pins: 2; Construction: Chip; Terminal Finish: Nickel; Max Operating Temperature: 155°C; Working Voltage: 50V; Packaging: Tape and Reel; Termination: Wraparound; JESD-609 Code: e3; Reach SVHC Compliant: Yes; Min Operating Temperature: -55°C
R9_MCU = CMP-009-00199-3: Fixed Resistor, Metal Glaze/thick Film, 0.0625W, 680000ohm, 50V, 5% +/-Tol, 100ppm/Cel, Surface Mount, 0402; AECQ: Yes; Max Operating Temperature: 155°C; Min Operating Temperature: -55°C; Mounting Technology: SMD; Pins: 2
R10_MCU R11_MCU R12_MCU = CMP-009-00225-1: Res Thick Film 0402 330 Ohm 1% 0.063W ±100ppm/°C Molded SMD Paper T/R; AECQ: Yes; Mounting Technology: Surface Mount; Max Operating Temperature: 155°C; RoHS Compliant: Yes; Pins: 2; Min Operating Temperature: -55°C
R13_MCU = CMP-009-00182-8: Fixed Resistor, Metal Glaze/thick Film, 0.0625W, 1000ohm, 50V, 1% +/-Tol, 100ppm/Cel, Surface Mount, 0402; Manufacturer Part Number: Blank; Package Width: 0.5mm; Rated Temperature: 70°C; AECQ: No; Package Length: 1mm; Additional Feature: LASER TRIMMABLE; Package Height: 0.35mm; Temperature Coefficient (ppm/Cel): 100; RoHS Compliant: Yes; Working Voltage: 50V; Min Operating Temperature: -55°C; Pins: 2; Reach SVHC Compliant: Yes; Technology: METAL GLAZE/THICK FILM; Terminal Finish: Nickel; Max Operating Temperature: 155°C; Resistor Type: FIXED RESISTOR; Package Shape: Rectangular; Mounting Technology: Surface Mount; Termination: Wraparound; JESD-609 Code: e3; Packaging: Tape and Reel; Construction: Chip
U1_MCU = CMP-020-00028-1: MCU 32-bit ARM Cortex M7 RISC 512KB Flash 1.8V/2.5V/3.3V 100-Pin LQFP Tray; Frequency: 550MHz; Min Operating Temperature: -40°C; Max Operating Temperature: 85°C; Case/Package: 100-LQFP (14x14); RoHS Compliant: Yes; PartId: 1
Y1_MCU = CMP-003-00031-2: Parallel - Fundamental Quartz Crystal, 0.032768MHz Nom; Frequency: 32.769kHz; Load Capacitance: 7pF; ESR: 80k; Min Operating Temperature: -40°C; Max Operating Temperature: 125°C; Case/Package: 3.2.x1.5; Pins: 2; RoHS Compliant: Yes
Y2_MCU = CMP-003-00030-1: Crystal 25.000 Mhz 12PF SMD; AECQ: Yes; ESR: 50; Frequency: 25MHz; Mounting Technology: SMD; Min Operating Temperature: -40°C; Case/Package: 3.2x2.5; Load Capacitance: 12pF; Pins: 4; Max Operating Temperature: 125°C

## Sheet Power.SchDoc: POWER
size 431 x 279 mm; SheetNumber: 6; SheetTotal: 14; SheetRevision: 1.0
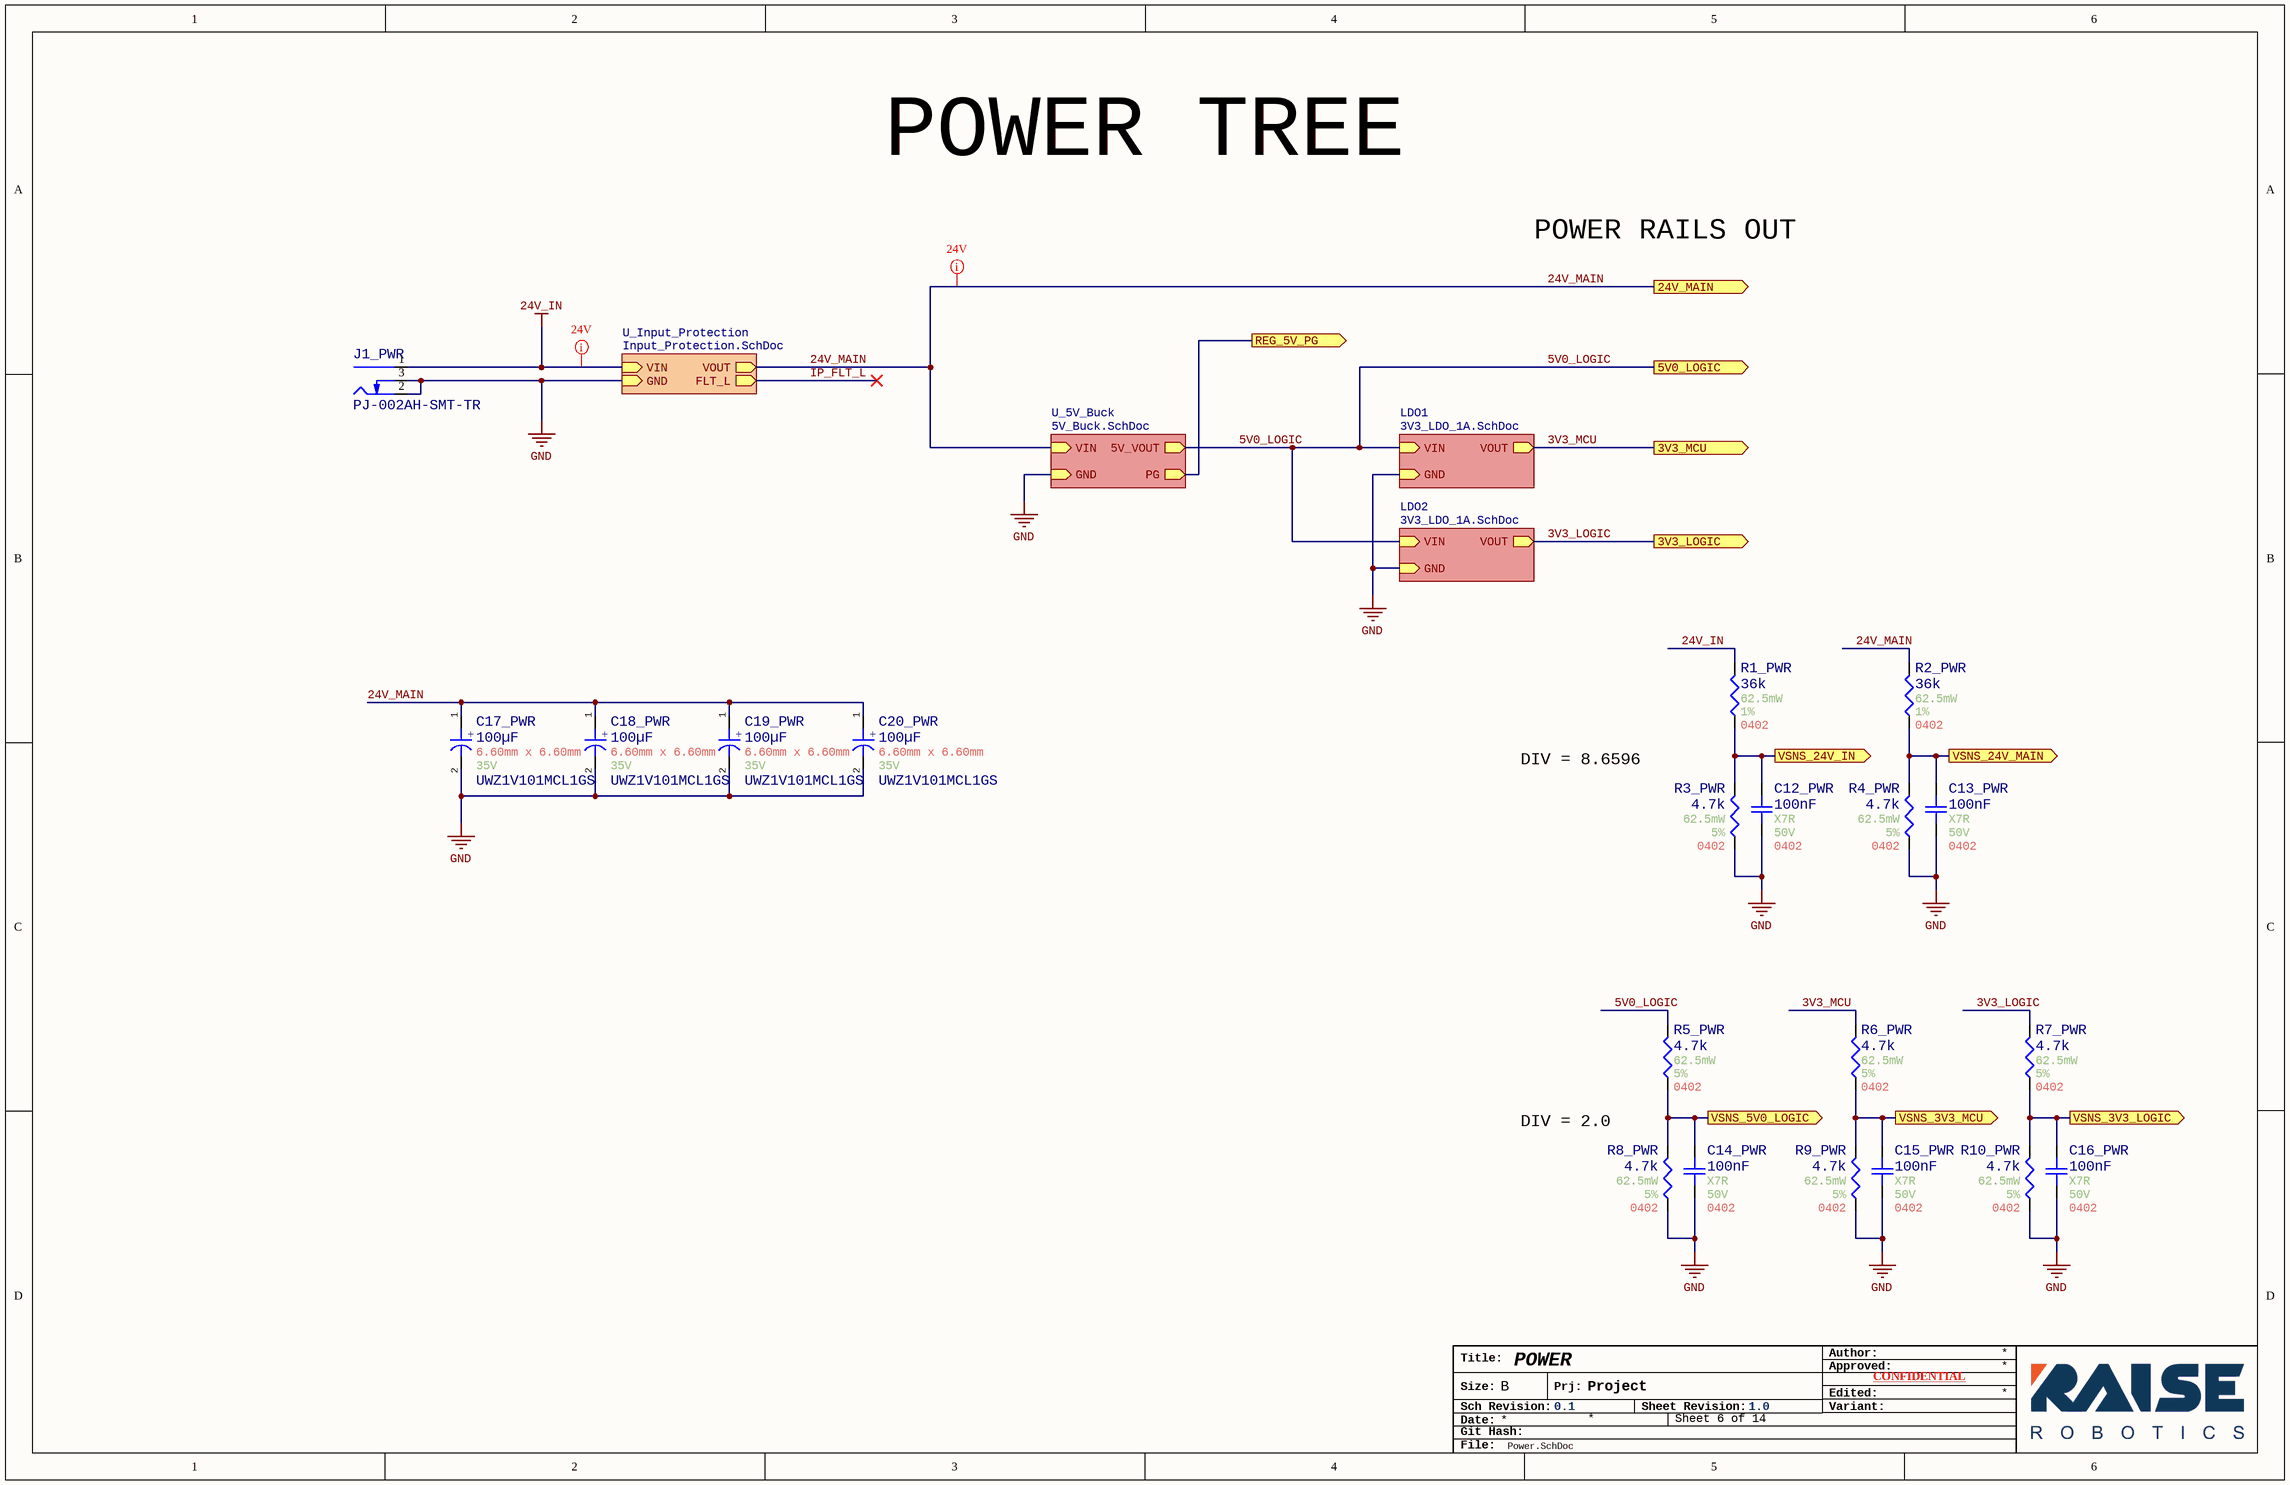
[diagram p2: Power.SchDoc]

### Parts
C12_PWR  value 100nF  Temperature Coefficient: X7R  Voltage Rating: 50V  Case/Package: 0402  [Generic 0402 capacitor]  (hidden comment: GRT155R71H104KE01D)
C13_PWR  value 100nF  Temperature Coefficient: X7R  Voltage Rating: 50V  Case/Package: 0402  [Generic 0402 capacitor]  (hidden comment: GRT155R71H104KE01D)
C14_PWR  value 100nF  Temperature Coefficient: X7R  Voltage Rating: 50V  Case/Package: 0402  [Generic 0402 capacitor]  (hidden comment: GRT155R71H104KE01D)
C15_PWR  value 100nF  Temperature Coefficient: X7R  Voltage Rating: 50V  Case/Package: 0402  [Generic 0402 capacitor]  (hidden comment: GRT155R71H104KE01D)
C16_PWR  value 100nF  Temperature Coefficient: X7R  Voltage Rating: 50V  Case/Package: 0402  [Generic 0402 capacitor]  (hidden comment: GRT155R71H104KE01D)
C17_PWR  UWZ1V101MCL1GS  value 100µF  Case/Package: 6.60mm x 6.60mm  Voltage Rating: 35V  [UWZ1V101MCL1GS]
C18_PWR  UWZ1V101MCL1GS  value 100µF  Case/Package: 6.60mm x 6.60mm  Voltage Rating: 35V  [UWZ1V101MCL1GS]
C19_PWR  UWZ1V101MCL1GS  value 100µF  Case/Package: 6.60mm x 6.60mm  Voltage Rating: 35V  [UWZ1V101MCL1GS]
C20_PWR  UWZ1V101MCL1GS  value 100µF  Case/Package: 6.60mm x 6.60mm  Voltage Rating: 35V  [UWZ1V101MCL1GS]
J1_PWR  PJ-002AH-SMT-TR  [CUI PJ-002AH-SMT-TR]
R1_PWR  value 36k  Power: 62.5mW  Tolerance: 1%  Case/Package: 0402  [Generic 0402 Resistor]  (hidden comment: AC0402FR-0736KL)
R2_PWR  value 36k  Power: 62.5mW  Tolerance: 1%  Case/Package: 0402  [Generic 0402 Resistor]  (hidden comment: AC0402FR-0736KL)
R3_PWR  value 4.7k  Power: 62.5mW  Tolerance: 5%  Case/Package: 0402  [Generic 0402 Resistor]  (hidden comment: WR04X472JTL)
R4_PWR  value 4.7k  Power: 62.5mW  Tolerance: 5%  Case/Package: 0402  [Generic 0402 Resistor]  (hidden comment: WR04X472JTL)
R5_PWR  value 4.7k  Power: 62.5mW  Tolerance: 5%  Case/Package: 0402  [Generic 0402 Resistor]  (hidden comment: WR04X472JTL)
R6_PWR  value 4.7k  Power: 62.5mW  Tolerance: 5%  Case/Package: 0402  [Generic 0402 Resistor]  (hidden comment: WR04X472JTL)
R7_PWR  value 4.7k  Power: 62.5mW  Tolerance: 5%  Case/Package: 0402  [Generic 0402 Resistor]  (hidden comment: WR04X472JTL)
R8_PWR  value 4.7k  Power: 62.5mW  Tolerance: 5%  Case/Package: 0402  [Generic 0402 Resistor]  (hidden comment: WR04X472JTL)
R9_PWR  value 4.7k  Power: 62.5mW  Tolerance: 5%  Case/Package: 0402  [Generic 0402 Resistor]  (hidden comment: WR04X472JTL)
R10_PWR  value 4.7k  Power: 62.5mW  Tolerance: 5%  Case/Package: 0402  [Generic 0402 Resistor]  (hidden comment: WR04X472JTL)

### Sub-sheets
LDO1 = 3V3_LDO_1A.SchDoc (file not in this document): VIN (in), VOUT (out), GND (in)
LDO2 = 3V3_LDO_1A.SchDoc (file not in this document): VIN (in), VOUT (out), GND (in)
U_5V_Buck = 5V_Buck.SchDoc: VIN (in), 5V_VOUT (out), GND (in), PG (out)
U_Input_Protection = Input_Protection.SchDoc: VIN (in), VOUT (out), GND (in), FLT_L (out)

### Ports
3V3_LOGIC (out), 3V3_MCU (out), 5V0_LOGIC (out), 24V_MAIN (out), REG_5V_PG (out), VSNS_3V3_LOGIC (out), VSNS_3V3_MCU (out), VSNS_5V0_LOGIC (out), VSNS_24V_IN (out), VSNS_24V_MAIN (out)

### Nets
3V3_LOGIC: R7_PWR.2 ; port 3V3_LOGIC, sheet LDO2/VOUT
3V3_MCU: R6_PWR.2 ; port 3V3_MCU, sheet LDO1/VOUT
5V0_LOGIC: R5_PWR.2 ; port 5V0_LOGIC, sheet U_5V_Buck/5V_VOUT, sheet LDO1/VIN, sheet LDO2/VIN
24V_IN: J1_PWR.1(Centre) R1_PWR.2 ; sheet U_Input_Protection/VIN
24V_MAIN: C17_PWR.1 C18_PWR.1 C19_PWR.1 C20_PWR.1 R2_PWR.2 ; port 24V_MAIN, sheet U_Input_Protection/VOUT, sheet U_5V_Buck/VIN
GND: C12_PWR.2 C13_PWR.2 C14_PWR.2 C15_PWR.2 C16_PWR.2 C17_PWR.2 C18_PWR.2 C19_PWR.2 C20_PWR.2 J1_PWR.2(Outer) J1_PWR.3(SW) R3_PWR.1 R4_PWR.1 R8_PWR.1 R9_PWR.1 R10_PWR.1 ; sheet U_Input_Protection/GND, sheet U_5V_Buck/GND, sheet LDO1/GND, sheet LDO2/GND
REG_5V_PG: port REG_5V_PG, sheet U_5V_Buck/PG
VSNS_3V3_LOGIC: C16_PWR.1 R7_PWR.1 R10_PWR.2 ; port VSNS_3V3_LOGIC
VSNS_3V3_MCU: C15_PWR.1 R6_PWR.1 R9_PWR.2 ; port VSNS_3V3_MCU
VSNS_5V0_LOGIC: C14_PWR.1 R5_PWR.1 R8_PWR.2 ; port VSNS_5V0_LOGIC
VSNS_24V_IN: C12_PWR.1 R1_PWR.1 R3_PWR.2 ; port VSNS_24V_IN
VSNS_24V_MAIN: C13_PWR.1 R2_PWR.1 R4_PWR.2 ; port VSNS_24V_MAIN

### Layout directives
net class HV_24V: 24V_IN, 24V_MAIN

### Notes on the sheet
- POWER TREE
- POWER RAILS OUT
- DIV = 8.6596
- DIV = 2.0
- Title:
- Author:
- Approved:
- Size:
- Date:
- Git Hash:
- Sch Revision:
- B
- Prj:
- Sheet Revision:
- Variant:
- Edited:
- CONFIDENTIAL
- File:
- (in symbol CMP-001-00099-2) +

### Library data of the parts
C12_PWR C13_PWR C14_PWR C15_PWR C16_PWR = CMP-001-00084-12: as C1 on sheet Top; Reach SVHC Compliant: Yes; Mounting Technology: Surface Mount; Termination: Wraparound; Pins: 2; Packaging: Tape and Reel; Package Shape: Rectangular; Multilayer: Yes; Tolerance: 10%; Max Operating Temperature: 125°C; Terminal Finish: Nickel; Capacitor Type: Ceramic; Dielectric Material: Ceramic; Min Operating Temperature: -55°C; RoHS Compliant: Yes
C17_PWR C18_PWR C19_PWR C20_PWR = CMP-001-00099-2: Aluminum Electrolytic Capacitor, Polarized, Aluminum (wet), 35V, 20% +Tol, 20% -Tol, 100uF, Surface Mount, 2626; Capacitor Type: Aluminium; AECQ: Yes; Ripple Current: 84mA; Min Operating Temperature: -55°C; Mounting Technology: Surface Mount; Max Operating Temperature: 105°C; RoHS Compliant: Yes; Pins: 2
J1_PWR = PJ-002AH-SMT-TR: CONN PWR JACK 2X5.5MM SOLDER; Manufacturer: CUI Devices; Actual Diameter: 0.079" (2.00mm ID), 0.256" (6.50mm OD); Current Rating (Amps): 5A; Gender: Male; Industry Recognized Mating Diameter: 2.00mm ID (0.079"), 5.50mm OD (0.217"); Internal Switch(s): Single Switch, Normally Closed; Material Flammability Rating: UL94 V-0; Mating Length/Depth: 0.350" (8.90mm); Number of Positions/Contacts: 2 Conductors, 3 Contacts; Shielding: Unshielded; Voltage - Rated: 24VDC; Part Number: PJ-002AH-SMT-TR; ComponentLink1Description: Datasheet; ComponentLink1URL: https://www.cuidevices.com/product/resource/digikeypdf/pj-002ah-smt-tr.pdf; ComponentLink2Description: DigiKey Link; ComponentLink2URL: http://digikey.com/product-detail/en/cui-devices/PJ-002AH-SMT-TR/CP-002AHPJCT-ND/669692; Connector Type: Jack; Features: Board Guide; LastUpdated: 5/26/2020 1:33:39 PM; Lifecycle Status: Active; Minimum Order: 1; Mounting Type: Surface Mount; Packaging: TapeAndReel; Part Status: Active; Price: 0.90; Series: -; Supplier 1: DigiKey; Supplier Part Number 1: CP-002AHPJCT-ND; Termination: Solder
R1_PWR R2_PWR = CMP-009-00198-3: Fixed Resistor, Metal Glaze/thick Film, 0.0625W, 36000ohm, 50V, 1% +/-Tol, 100ppm/Cel, Surface Mount, 0402; AECQ: Yes; Mounting Technology: SMD; Pins: 2; Max Operating Temperature: 155°C; Min Operating Temperature: -55°C
R3_PWR R4_PWR R8_PWR R9_PWR R10_PWR = CMP-009-00184-8: Fixed Resistor, Metal Glaze/thick Film, 0.0625W, 4700ohm, 50V, 5% +/-Tol, 100ppm/Cel, Surface Mount, 0402; Manufacturer Part Number: Blank; AECQ: No; Package Height: 0.35mm; Package Length: 1mm; Rated Temperature: 70°C; Package Width: 0.5mm; Temperature Coefficient (ppm/Cel): 200; Additional Feature: LASER TRIMMABLE; Pins: 2; Mounting Technology: Surface Mount; Min Operating Temperature: -55°C; RoHS Compliant: Yes; Max Operating Temperature: 155°C; Technology: METAL GLAZE/THICK FILM; Resistor Type: FIXED RESISTOR; Package Shape: Rectangular; Construction: Chip; Terminal Finish: Nickel; Working Voltage: 50V; Packaging: Tape and Reel; Termination: Wraparound; JESD-609 Code: e3; Reach SVHC Compliant: Yes
R5_PWR R6_PWR R7_PWR = CMP-009-00184-8: as R2_MCU on sheet MCU; Mounting Technology: Surface Mount; Technology: METAL GLAZE/THICK FILM; RoHS Compliant: Yes; Resistor Type: FIXED RESISTOR; Package Shape: Rectangular; Pins: 2; Construction: Chip; Terminal Finish: Nickel; Max Operating Temperature: 155°C; Working Voltage: 50V; Packaging: Tape and Reel; Termination: Wraparound; JESD-609 Code: e3; Reach SVHC Compliant: Yes; Min Operating Temperature: -55°C

## Sheet Input_Protection.SchDoc: Input Protection
size 431 x 279 mm; Author: Shivam Sharma; SheetNumber: 9; SheetTotal: 14; SheetRevision: 1.0
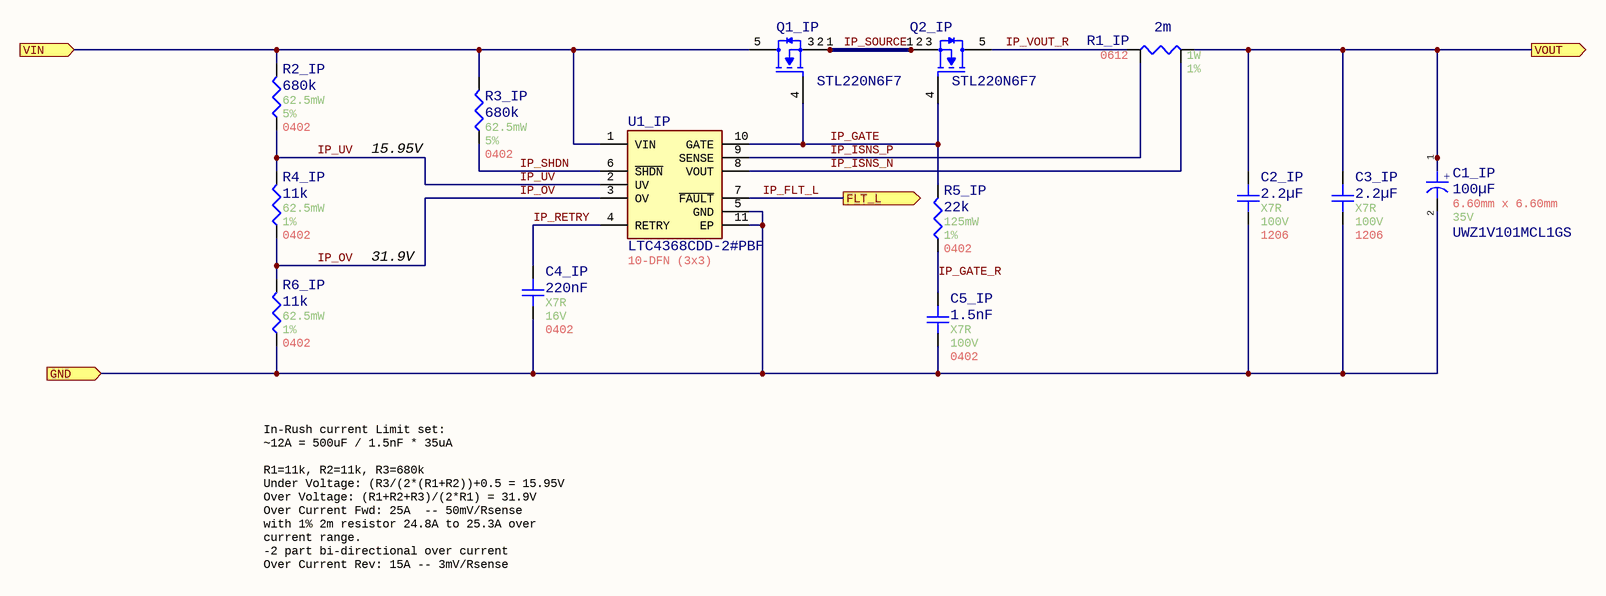
[diagram p3: Input_Protection.SchDoc]

### Parts
C1_IP  UWZ1V101MCL1GS  value 100µF  Case/Package: 6.60mm x 6.60mm  Voltage Rating: 35V  [UWZ1V101MCL1GS]
C2_IP  value 2.2µF  Temperature Coefficient: X7R  Voltage Rating: 100V  Case/Package: 1206  [Generic 1206 Capacitor]  (hidden comment: 12061C225K4T2A)
C3_IP  value 2.2µF  Temperature Coefficient: X7R  Voltage Rating: 100V  Case/Package: 1206  [Generic 1206 Capacitor]  (hidden comment: 12061C225K4T2A)
C4_IP  value 220nF  Temperature Coefficient: X7R  Voltage Rating: 16V  Case/Package: 0402  [Generic 0402 capacitor]  (hidden comment: GCM155R71C224ME02D)
C5_IP  value 1.5nF  Temperature Coefficient: X7R  Voltage Rating: 100V  Case/Package: 0402  [Generic 0402 capacitor]  (hidden comment: GCM155R72A152KA37D)
Q1_IP  STL220N6F7  [STL220N6F7]
Q2_IP  STL220N6F7  [STL220N6F7]
R1_IP  value 2m  Power: 1W  Tolerance: 1%  Case/Package: 0612  [FP-WSKW0612-MFG]  (hidden comment: WSKW06122L000FEA)
R2_IP  value 680k  Power: 62.5mW  Tolerance: 5%  Case/Package: 0402  [Generic 0402 Resistor]  (hidden comment: AC0402JR-07680KL)
R3_IP  value 680k  Power: 62.5mW  Tolerance: 5%  Case/Package: 0402  [Generic 0402 Resistor]  (hidden comment: AC0402JR-07680KL)
R4_IP  value 11k  Power: 62.5mW  Tolerance: 1%  Case/Package: 0402  [Generic 0402 Resistor]  (hidden comment: RMCF0402FT11K0)
R5_IP  value 22k  Power: 125mW  Tolerance: 1%  Case/Package: 0402  [Generic 0402 Resistor]  (hidden comment: AC0402FR-7W22KL)
R6_IP  value 11k  Power: 62.5mW  Tolerance: 1%  Case/Package: 0402  [Generic 0402 Resistor]  (hidden comment: RMCF0402FT11K0)
U1_IP  LTC4368CDD-2#PBF  Case/Package: 10-DFN (3x3)  [DFN-10_3x3x0.8mm_P0.5mm]

### Ports
FLT_L (out), GND (in), VIN (in), VOUT (out)

### Nets
24V_IN: Q1_IP.5(DRAIN) R2_IP.2 R3_IP.2 U1_IP.1(VIN) ; port VIN
24V_MAIN: C1_IP.1 C2_IP.2 C3_IP.2 R1_IP.2 ; port VOUT
GND: C1_IP.2 C2_IP.1 C3_IP.1 C4_IP.1 C5_IP.1 R6_IP.1 U1_IP.5(GND) U1_IP.11(EP) ; port GND
IP_FLT_L: U1_IP.7(~{FAULT}) ; port FLT_L
IP_GATE: Q1_IP.4(GATE) Q2_IP.4(GATE) R5_IP.2 U1_IP.10(GATE)
IP_GATE_R: C5_IP.2 R5_IP.1
IP_ISNS_N: R1_IP.S2 U1_IP.8(VOUT)
IP_ISNS_P: R1_IP.S1 U1_IP.9(SENSE)
IP_OV: R4_IP.1 R6_IP.2 U1_IP.3(OV)
IP_RETRY: C4_IP.2 U1_IP.4(RETRY)
IP_SHDN: R3_IP.1 U1_IP.6(~{SHDN})
IP_SOURCE: Q1_IP.1(SOURCE) Q1_IP.2(SOURCE) Q1_IP.3(SOURCE) Q2_IP.1(SOURCE) Q2_IP.2(SOURCE) Q2_IP.3(SOURCE)
IP_UV: R2_IP.1 R4_IP.2 U1_IP.2(UV)
IP_VOUT_R: Q2_IP.5(DRAIN) R1_IP.1

### Notes on the sheet
- 15.95V
- 31.9V
- In-Rush current Limit set:
  ~12A = 500uF / 1.5nF * 35uA
  R1=11k, R2=11k, R3=680k
  Under Voltage: (R3/(2*(R1+R2))+0.5 = 15.95V
  Over Voltage: (R1+R2+R3)/(2*R1) = 31.9V
  Over Current Fwd: 25A  -- 50mV/Rsense
  with 1% 2m resistor 24.8A to 25.3A over current range.
  -2 part bi-directional over current
  Over Current Rev: 15A -- 3mV/Rsense
- Title:
- Author:
- Approved:
- Size:
- Date:
- Git Hash:
- Sch Revision:
- B
- Prj:
- Sheet Revision:
- Variant:
- Edited:
- CONFIDENTIAL
- File:
- (in symbol CMP-001-00099-2) +

### Library data of the parts
C1_IP = CMP-001-00099-2: Aluminum Electrolytic Capacitor, Polarized, Aluminum (wet), 35V, 20% +Tol, 20% -Tol, 100uF, Surface Mount, 2626; AECQ: Yes; Capacitor Type: Aluminium; Ripple Current: 84mA; Pins: 2; Max Operating Temperature: 105°C; Min Operating Temperature: -55°C; RoHS Compliant: Yes; Mounting Technology: Surface Mount
C2_IP C3_IP = CMP-001-00086-3: Ceramic Capacitor, Multilayer, Ceramic, 100V, 10% +Tol, 10% -Tol, X7R, 15% TC, 2.2uF, Surface Mount, 1206; AECQ: Yes; Capacitor Type: Ceramic; Max Operating Temperature: -55°C; Tolerance: 10%; Min Operating Temperature: 125°C; Pins: 2; RoHS Compliant: Yes; Mounting Technology: SMD
C4_IP = CMP-001-00103-2: Ceramic Capacitor, Multilayer, Ceramic, 16V, 20% +Tol, 20% -Tol, X7R, 15% TC, 0.22uF, Surface Mount, 0402; AECQ: Yes; Max Operating Temperature: 125°C; Min Operating Temperature: -55°C; Mounting Technology: SMD; Pins: 2; Capacitor Type: Ceramic; Tolerance: 20%
C5_IP = CMP-001-00102-3: Ceramic Capacitor, Multilayer, Ceramic, 100V, 10% +Tol, 10% -Tol, X7R, 15% TC, 0.0015uF, Surface Mount, 0402; AECQ: Yes; Capacitor Type: Ceramic; Min Operating Temperature: -55°C; Mounting Technology: SMD; Max Operating Temperature: 125°C; Tolerance: 10%; Pins: 2
Q1_IP Q2_IP = CMP-013-00035-1: Power Field-Effect Transistor, 120A I(D), 60V, 0.0014ohm, 1-Element, N-Channel, Silicon, Metal-oxide Semiconductor FET; Transistor Type: n-FET; Power: 4.8W; Min Operating Temperature: -55°C; Pins: 8; Case/Package: 8-PowerVDFN; RoHS Compliant: Yes; Max Operating Temperature: 175°C
R1_IP = CMP-009-00192-1: Fixed Resistor, Metal Strip, 1W, 0.002ohm, 0.045V, 1% +/-Tol, 150ppm/Cel, Surface Mount, 0612; Manufacturer Part Number: TFA0805R60R4F-T5; AECQ: Yes; Mounting Technology: Surface Mount; Min Operating Temperature: -65°C; Max Operating Temperature: 170°C; RoHS Compliant: Yes; Pins: 4
R2_IP R3_IP = CMP-009-00199-3: as R9_MCU on sheet MCU; Mounting Technology: SMD; Pins: 2; Min Operating Temperature: -55°C; Max Operating Temperature: 155°C
R4_IP R6_IP = CMP-009-00221-1: Res Thick Film 0402 11K Ohm 1% 0.063W(1/16W) ±100ppm/C Pad SMD Automotive T/R; AECQ: Yes; Pins: 2; RoHS Compliant: Yes; Max Operating Temperature: 155°C; Mounting Technology: Surface Mount; Min Operating Temperature: -55°C
R5_IP = CMP-009-00193-3: Fixed Resistor, Metal Glaze/thick Film, 0.125W, 22000ohm, 75V, 1% +/-Tol, 100ppm/Cel, Surface Mount, 0402; AECQ: Yes; Manufacturer Part Number: AC0402FR-7W22KL; Mounting Technology: SMD; Pins: 2; Max Operating Temperature: 155°C; Min Operating Temperature: -55°C
U1_IP = CMP-031-00016-1: 100V UV/OV and Reverse Protection Controller with Bidirectional Circuit Breaker; MPN: LTC4368CMS-1#PBF; AECQ: Yes; Mounting Technology: SMD; Pins: 10; Max Operating Temperature: 70°C; Min Operating Temperature: 0°C; RoHS Compliant: Yes

## Sheet 5V_Buck.SchDoc: 5V_BUCK
size 431 x 279 mm; Author: Shivam Sharma; SheetNumber: 8; SheetTotal: 14; SheetRevision: 1.0
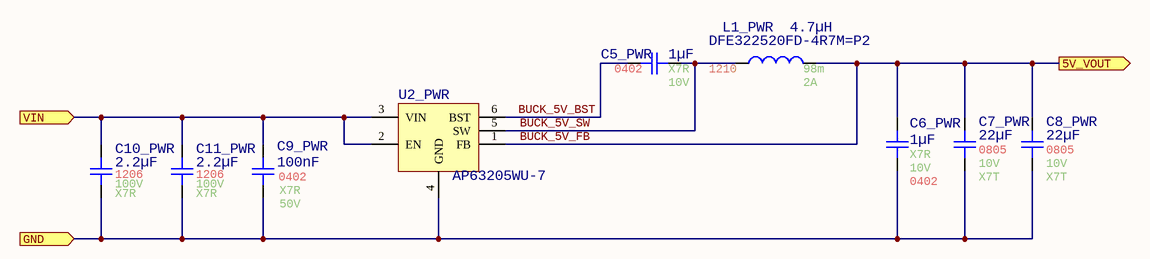
[diagram p4: 5V_Buck.SchDoc]

### Parts
C5_PWR  value 1µF  Temperature Coefficient: X7R  Voltage Rating: 10V  Case/Package: 0402  [Generic 0402 capacitor]  (hidden comment: MAASL105CD7105MFCA01)
C6_PWR  value 1µF  Temperature Coefficient: X7R  Voltage Rating: 10V  Case/Package: 0402  [Generic 0402 capacitor]  (hidden comment: MAASL105CD7105MFCA01)
C7_PWR  value 22µF  Temperature Coefficient: X7T  Voltage Rating: 10V  Case/Package: 0805  [Generic 0805 Cap]  (hidden comment: GRT21BD71A226ME13L)
C8_PWR  value 22µF  Temperature Coefficient: X7T  Voltage Rating: 10V  Case/Package: 0805  [Generic 0805 Cap]  (hidden comment: GRT21BD71A226ME13L)
C9_PWR  value 100nF  Temperature Coefficient: X7R  Voltage Rating: 50V  Case/Package: 0402  [Generic 0402 capacitor]  (hidden comment: GRT155R71H104KE01D)
C10_PWR  value 2.2µF  Temperature Coefficient: X7R  Voltage Rating: 100V  Case/Package: 1206  [Generic 1206 Capacitor]  (hidden comment: 12061C225K4T2A)
C11_PWR  value 2.2µF  Temperature Coefficient: X7R  Voltage Rating: 100V  Case/Package: 1206  [Generic 1206 Capacitor]  (hidden comment: 12061C225K4T2A)
L1_PWR  DFE322520FD-4R7M=P2  value 4.7µH  DCR: 98m  Current Rating: 2A  Case/Package: 1210  [FP-DFE322520F_D-IPC_A]
U2_PWR  AP63205WU-7  [TSOT-26-6 - 3.2mm]

### Ports
5V_VOUT (out), GND (in), VIN (in)

### Nets
24V_MAIN: C9_PWR.1 C10_PWR.2 C11_PWR.2 U2_PWR.2(EN) U2_PWR.3(VIN) ; port VIN
BUCK_5V_FB: C6_PWR.2 C7_PWR.2 C8_PWR.2 L1_PWR.2 U2_PWR.1(FB) ; port 5V_VOUT  [project net 5V0_LOGIC]
GND: C6_PWR.1 C7_PWR.1 C8_PWR.1 C9_PWR.2 C10_PWR.1 C11_PWR.1 U2_PWR.4(GND) ; port GND
BUCK_5V_BST: C5_PWR.2 U2_PWR.6(BST)
BUCK_5V_SW: C5_PWR.1 L1_PWR.1 U2_PWR.5(SW)

### Notes on the sheet
- Title:
- Author:
- Approved:
- Size:
- Date:
- Git Hash:
- Sch Revision:
- B
- Prj:
- Sheet Revision:
- Variant:
- Edited:
- CONFIDENTIAL
- File:

### Library data of the parts
C5_PWR C6_PWR = CMP-001-00104-2: Cap Cer 1UF 20V X7T 0402; AECQ: Yes; Capacitor Type: Ceramic; Tolerance: 20%; Min Operating Temperature: -55°C; Max Operating Temperature: 125°C; Pins: 2; RoHS Compliant: Yes; Mounting Technology: Surface Mount
C7_PWR C8_PWR = CMP-001-00095-2: 22 µF ±20% 10V Ceramic Capacitor X7T 0805 (2012 Metric); AECQ: Yes; Mounting Technology: SMD; Tolerance: 20%; Capacitor Type: Ceramic; Min Operating Temperature: -55°C; Pins: 2; Max Operating Temperature: 125°C
C9_PWR = CMP-001-00084-12: as C1 on sheet Top; Reach SVHC Compliant: Yes; Mounting Technology: Surface Mount; Termination: Wraparound; Pins: 2; Packaging: Tape and Reel; Package Shape: Rectangular; Multilayer: Yes; Tolerance: 10%; Max Operating Temperature: 125°C; Terminal Finish: Nickel; Capacitor Type: Ceramic; Dielectric Material: Ceramic; Min Operating Temperature: -55°C; RoHS Compliant: Yes
C10_PWR C11_PWR = CMP-001-00086-3: as C2_IP on sheet Input_Protection; RoHS Compliant: Yes; Mounting Technology: SMD; Min Operating Temperature: 125°C; Max Operating Temperature: -55°C; Capacitor Type: Ceramic; Tolerance: 10%; Pins: 2
L1_PWR = CMP-006-00022-5: General Purpose Inductor, 4.7uH, 20%, 1 Element, Metal Alloy-Core, SMD, 1210; AECQ: Yes; ComponentLink2Description: https://www.bourns.com/docs/Product-Datasheets/SRP4021HMCT.pdf; Min Operating Temperature: -40°C; Tolerance: 20%; Max Operating Temperature: 125°C; Pins: 2
U2_PWR = AP63205WU-7: 5V fixed step down Buck

## Sheet CAN_PHY.SchDoc: CAN PHY
size 431 x 279 mm; Author: Shivam Sharma; SheetNumber: 3; SheetTotal: 14; SheetRevision: 1.0
Used 2 times, as channels CAN0, CAN1. Parts and nets are listed once, with the designators drawn on the sheet.
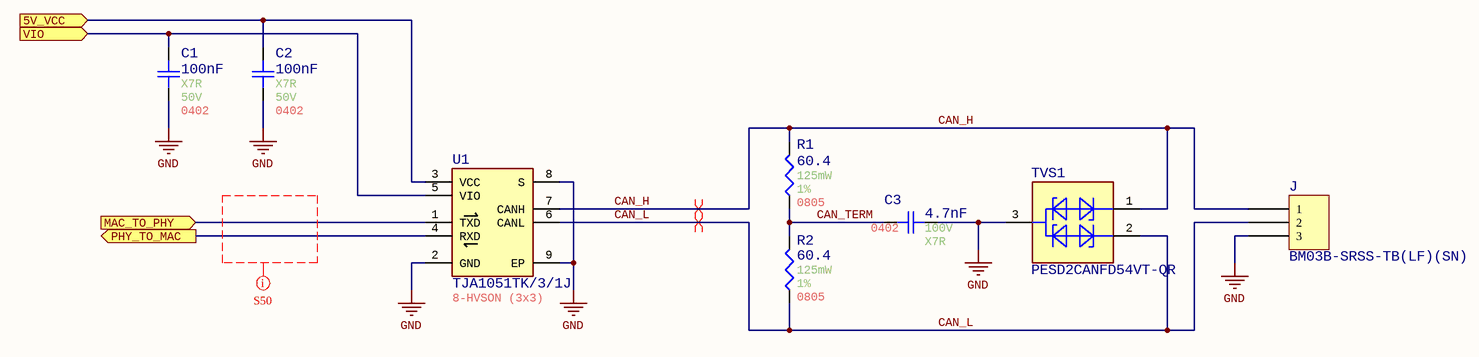
[diagram p5: CAN_PHY.SchDoc]

### Parts
C1  value 100nF  Temperature Coefficient: X7R  Voltage Rating: 50V  Case/Package: 0402  [Generic 0402 capacitor]  (hidden comment: GRT155R71H104KE01D)
C2  value 100nF  Temperature Coefficient: X7R  Voltage Rating: 50V  Case/Package: 0402  [Generic 0402 capacitor]  (hidden comment: GRT155R71H104KE01D)
C3  value 4.7nF  Temperature Coefficient: X7R  Voltage Rating: 100V  Case/Package: 0402  [Generic 0402 capacitor]  (hidden comment: GCM155R72A472KA37D)
J  BM03B-SRSS-TB(LF)(SN)  [JST BM03B-SRSS-TB]
R1  value 60.4  Power: 125mW  Tolerance: 1%  Case/Package: 0805  [0805 Resistor]  (hidden comment: TFA0805R60R4F-T5)
R2  value 60.4  Power: 125mW  Tolerance: 1%  Case/Package: 0805  [0805 Resistor]  (hidden comment: TFA0805R60R4F-T5)
TVS1  PESD2CANFD54VT-QR  [PESD2CANFD54VT-QR]
U1  TJA1051TK/3/1J  Case/Package: 8-HVSON (3x3)  [TJA1044xxK]

### Ports
5V_VCC (in), MAC_TO_PHY (in), PHY_TO_MAC (out), VIO (in)

### Nets
GND: C1.2 C2.2 C3.1 J.3 TVS1.3(CC) U1.2(GND) U1.8(S) U1.9(EP)
5V_VCC: C2.1 U1.3(VCC) ; port 5V_VCC
CAN_H: J.1 R1.2 TVS1.1(K1) U1.7(CANH)
CAN_L: J.2 R2.1 TVS1.2(K2) U1.6(CANL)
CAN_TERM: C3.2 R1.1 R2.2
MAC_TO_PHY: U1.1(TXD) ; port MAC_TO_PHY
PHY_TO_MAC: U1.4(RXD) ; port PHY_TO_MAC
VIO: C1.1 U1.5(VIO) ; port VIO

### Channels
CAN0: designators end in _CAN0; ports 5V_VCC=5V0_LOGIC MAC_TO_PHY=CAN0_MCU_TO_PHY_DATA PHY_TO_MAC=CAN0_PHY_TO_MCU_DATA VIO=3V3_LOGIC
CAN1: designators end in _CAN1; ports 5V_VCC=5V0_LOGIC MAC_TO_PHY=CAN1_MCU_TO_PHY_DATA PHY_TO_MAC=CAN1_PHY_TO_MCU_DATA VIO=3V3_LOGIC

### Layout directives
differential pair; differential pair class CAN: CAN_H_CAN0, CAN_L_CAN0
net class S50: (no net found under the mark)

### Notes on the sheet
- Title:
- Author:
- Approved:
- Size:
- Date:
- Git Hash:
- Sch Revision:
- B
- Prj:
- Sheet Revision:
- Variant:
- Edited:
- CONFIDENTIAL
- File:

### Library data of the parts
C1 C2 = CMP-001-00084-12: as C1 on sheet Top; RoHS Compliant: Yes; Package Shape: Rectangular; Max Operating Temperature: 125°C; Terminal Finish: Nickel; Multilayer: Yes; Dielectric Material: Ceramic; Mounting Technology: Surface Mount; Termination: Wraparound; Reach SVHC Compliant: Yes; Min Operating Temperature: -55°C; Tolerance: 10%; Packaging: Tape and Reel; Pins: 2; Capacitor Type: Ceramic
C3 = CMP-001-00110-2: Ceramic Capacitor, Multilayer, Ceramic, 100V, 10% +Tol, 10% -Tol, X7R, 15% TC, 0.0047uF, Surface Mount, 0402; AECQ: Yes; Min Operating Temperature: -55°C; Mounting Technology: SMD; Tolerance: 10%; Max Operating Temperature: 125°C; RoHS Compliant: Yes; Pins: 2; Capacitor Type: Ceramic
J = BM03B-SRSS-TB(LF)(SN): CONN HEADER SMD 3POS 1MM; Manufacturer: JST Sales America Inc.; Current Rating (Amps): 0.7A; Material Flammability Rating: UL94 V-0; Number of Positions: 3; Number of Positions Loaded: All; Pitch - Mating: 0.039" (1.00mm); Shrouding: Shrouded - 4 Wall; Style: Board to Cable/Wire; Voltage Rating: 50V; Part Number: BM03B-SRSS-TB(LF)(SN); ComponentLink1Description: Datasheet; ComponentLink1URL: http://www.jst-mfg.com/product/pdf/eng/eSR.pdf; ComponentLink2Description: DigiKey Link; ComponentLink2URL: http://digikey.com/product-detail/en/jst-sales-america-inc/BM03B-SRSS-TB-LF-SN/455-1789-1-ND/926860; Connector Type: Header; Contact Finish - Mating: Tin; Contact Finish - Post: Tin; Contact Material: Copper Alloy; Contact Shape: Square; Contact Type: Male Pin; Fastening Type: Push-Pull; Features: Solder Retention; Insulation Color: Natural; Insulation Height: 0.167" (4.25mm); Insulation Material: Polyamide (PA), Nylon; LastUpdated: 1/12/2020 10:12:14 PM; Lifecycle Status: Active; Minimum Order: 1; Mounting Type: Surface Mount; Number of Rows: 1; Operating Temperature: -25°C ~ 85°C; Packaging: TapeAndReel; PartId: 14; Part Status: Active; Price: 0.24; Series: SR; Supplier 1: DigiKey; Supplier Part Number 1: 455-1789-1-ND; Termination: Solder
R1 R2 = CMP-009-00189-2: Res 60.4 Ohm 1% 1/8W 0805; AECQ: Yes; Manufacturer Part Number: TFA0805R60R4F-T5; Mounting Technology: SMD; Pins: 2
TVS1 = CMP-004-00032-1: ESD protection for in-vehicle networks; AECQ: Yes; Pins: 3; Case/Package: TO-236AB
U1 = CMP-031-00007-4: Interface Circuit, PDSO8; AECQ: Yes; Max Operating Temperature: 150°C; Pins: 8; Min Operating Temperature: -40°C; MPN: TJA1051TK/3/1J